# EAGLE design SolarPanel (EAGLE 9.5.1)
DESIGNER: Hendrik Melse; PART_NUMBER: 68-0001; PROJECT: CougSat-1: Solar; REV: 2.1.0
Assembly variants: PV0 (+Z), PV1 (-Y), PV2 (-X), PV3 (+Y)

## Sheet 1 of 5
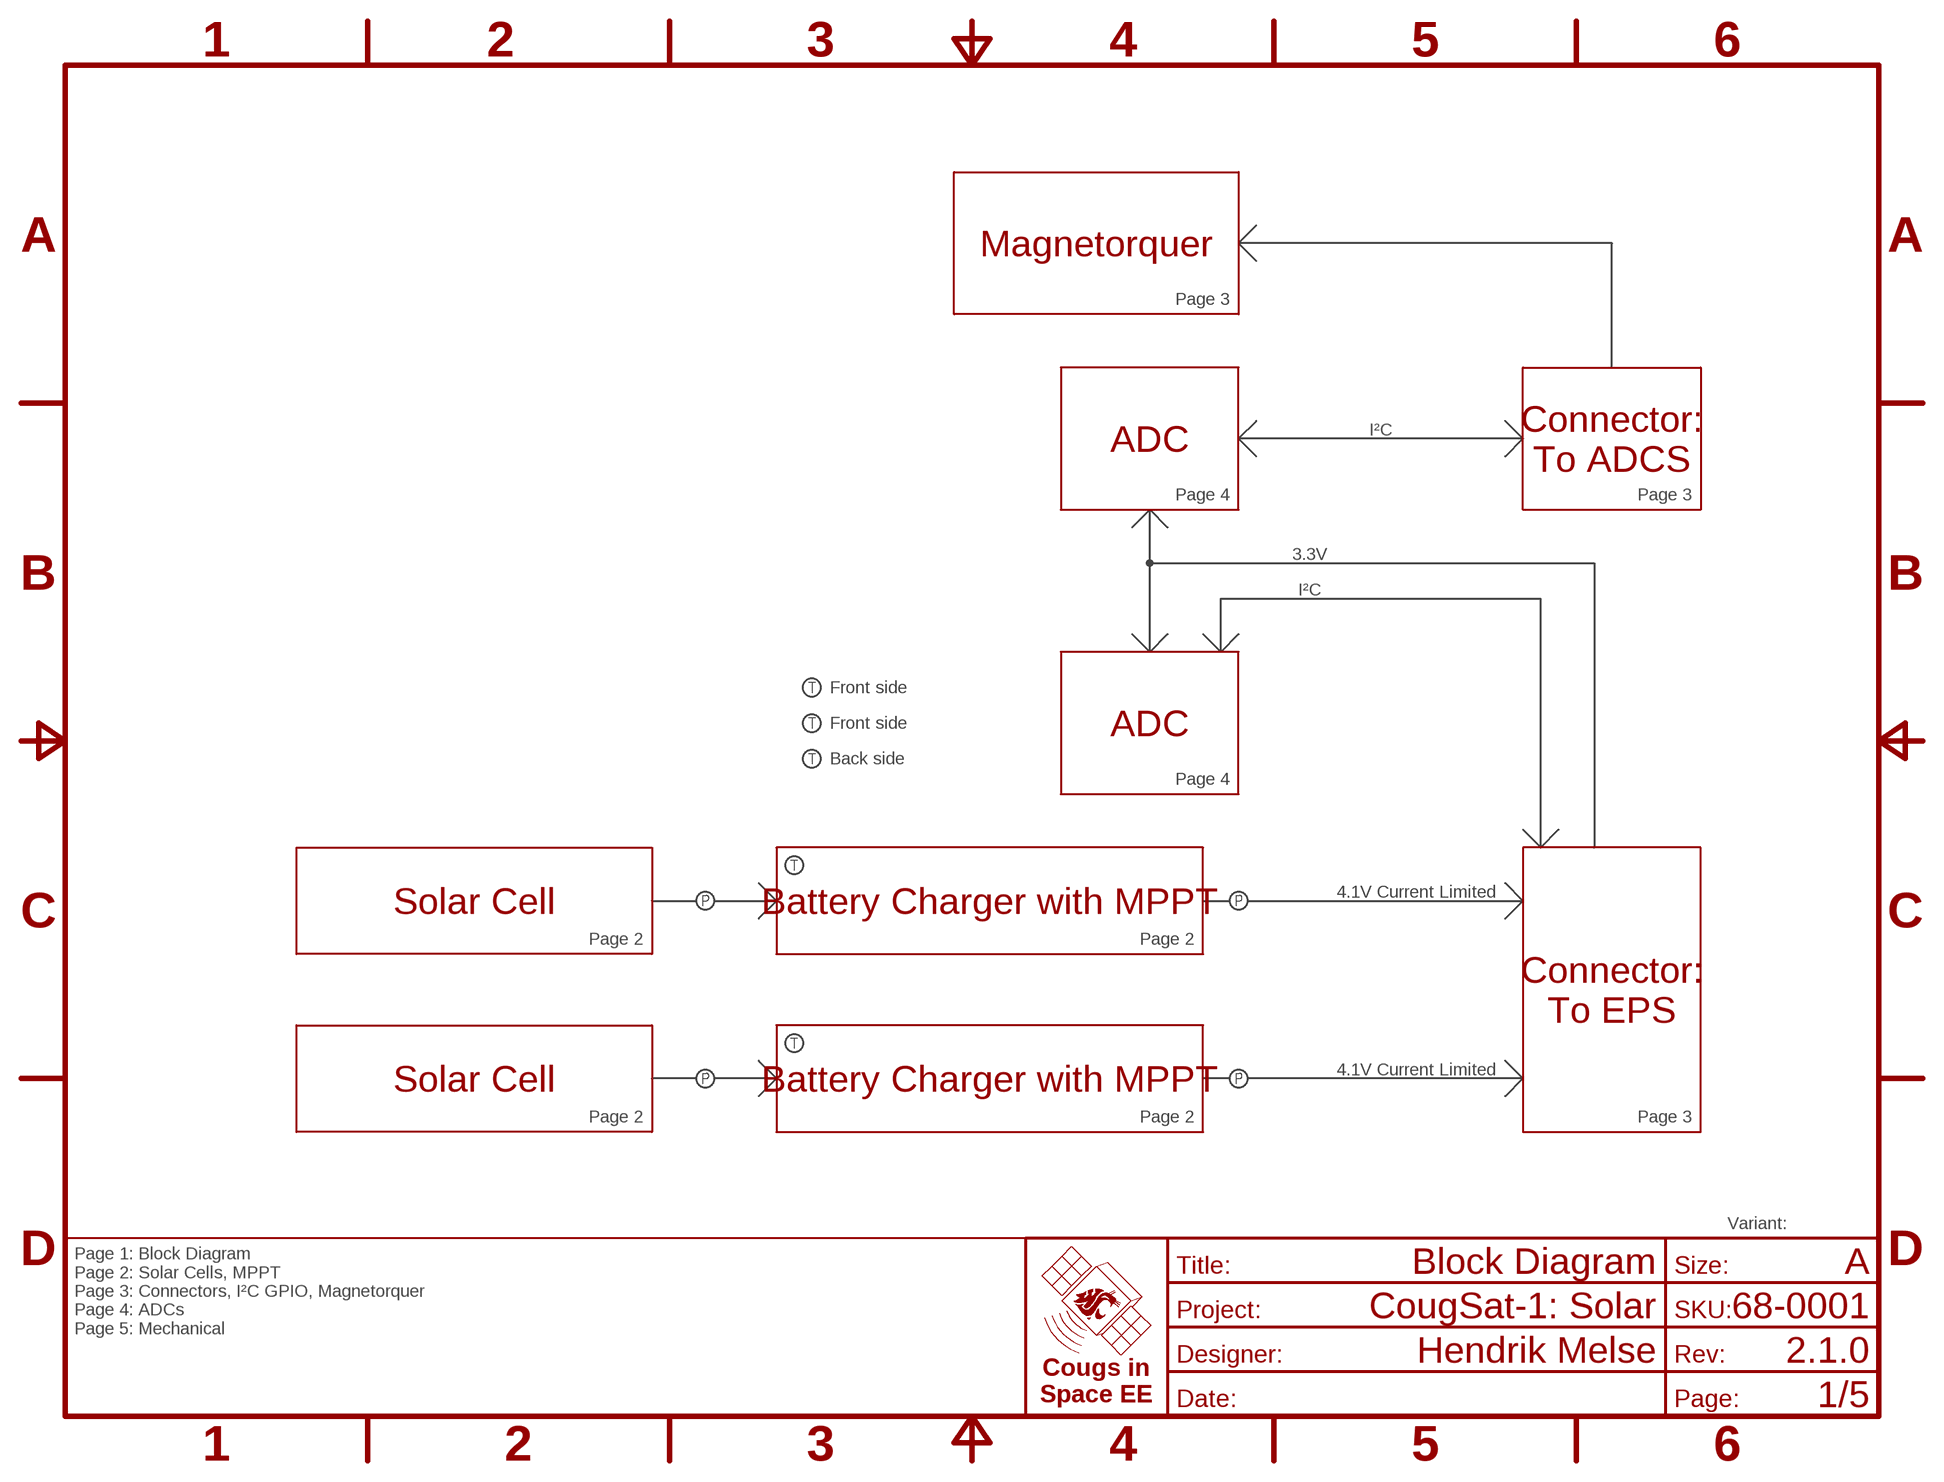
[diagram p0: schematic, sheet 1]
FRAME1 (FRAME-A): TITLE: Block Diagram

### Notes on the sheet
- Magnetorquer
- Page 3
- I²C
- ADC
- Connector:
  To ADCS
- Page 4 | Page 3
- 3.3V
- I²C
- Front side
- Front side | ADC
- Back side
- Page 4
- 4.1V Current Limited
- Solar Cell | Battery Charger with MPPT
- Page 2 | Page 2
- Connector:
  To EPS
- 4.1V Current Limited
- Solar Cell | Battery Charger with MPPT
- Page 2 | Page 2 | Page 3
- Variant:
- Page 1: Block Diagram
  Page 2: Solar Cells, MPPT
  Page 3: Connectors, I²C GPIO, Magnetorquer
  Page 4: ADCs
  Page 5: Mechanical

## Sheet 2 of 5
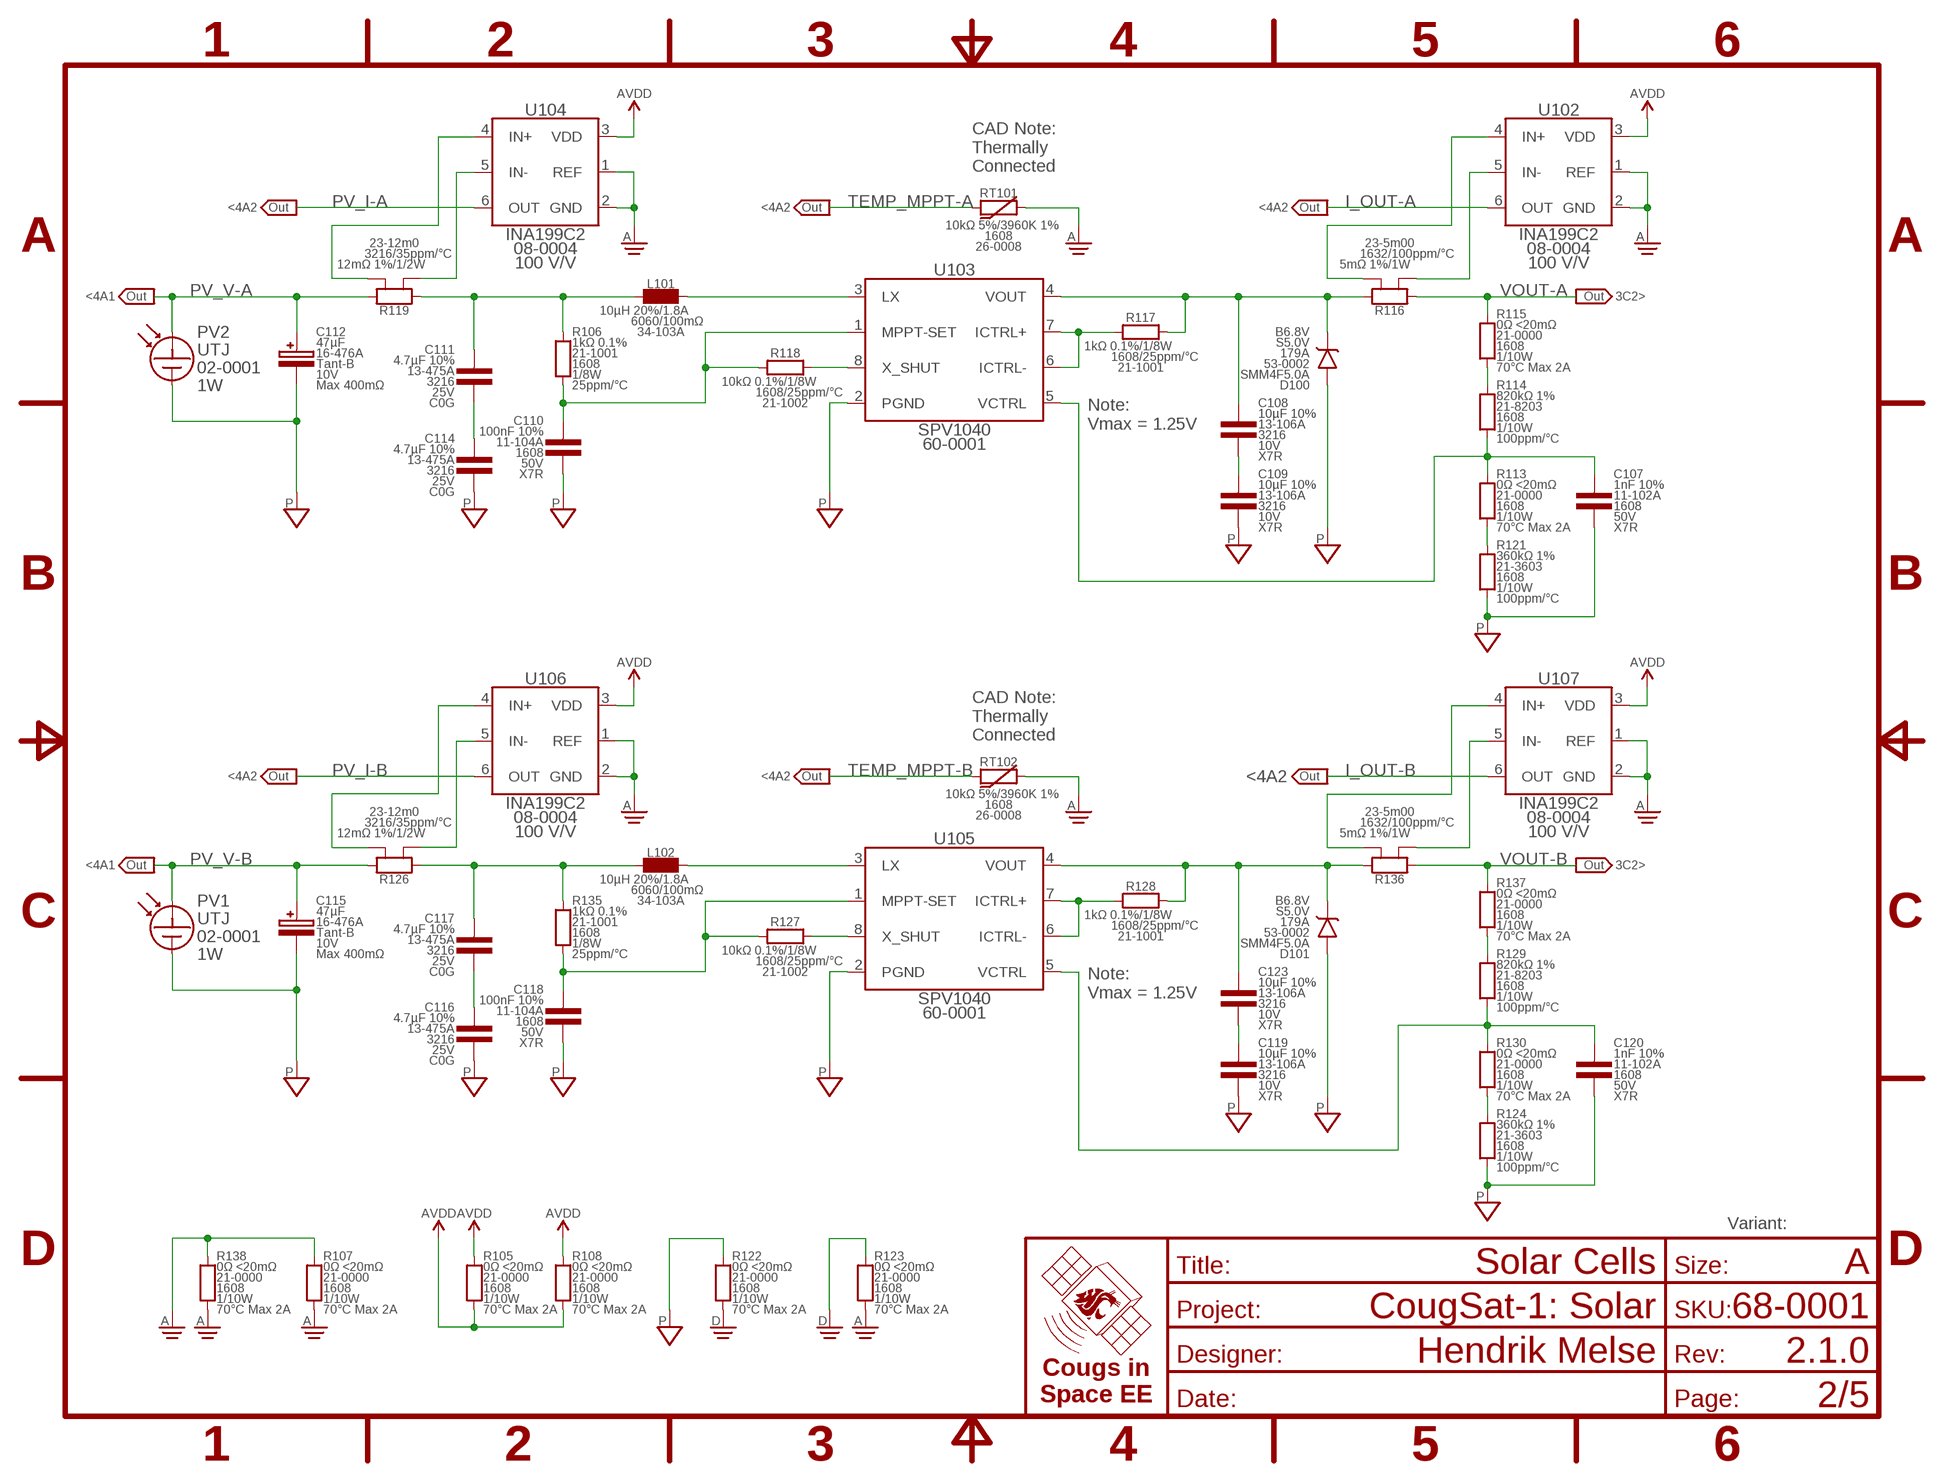
[diagram p1: schematic, sheet 2]
FRAME2 (FRAME-A): TITLE: Solar Cells

### Parts
C107  1nF 10%  CAP-V-1NF-1608  [1608]
C108  10µF 10%  CAP-V-10UF-3216  [3216]
C109  10µF 10%  CAP-V-10UF-3216  [3216]
C110  100nF 10%  CAP-V-100NF-1608  [1608]
C111  4.7µF 10%  CAP-V-4.7UF-3216  [3216]
C112  47µF  CAP-POL-V-47UF-4028  [4028-POL]
C114  4.7µF 10%  CAP-V-4.7UF-3216  [3216]
C115  47µF  CAP-POL-V-47UF-4028  [4028-POL]
C116  4.7µF 10%  CAP-V-4.7UF-3216  [3216]
C117  4.7µF 10%  CAP-V-4.7UF-3216  [3216]
C118  100nF 10%  CAP-V-100NF-1608  [1608]
C119  10µF 10%  CAP-V-10UF-3216  [3216]
C120  1nF 10%  CAP-V-1NF-1608  [1608]
C123  10µF 10%  CAP-V-10UF-3216  [3216]
D100  SMM4F5.0A  DIODE-TVS-V-5.0-STMITE  [STMITE]
D101  SMM4F5.0A  DIODE-TVS-V-5.0-STMITE  [STMITE]
L101  10µH 20%  INDUCTOR-H-10UH-6060  [6060]
L102  10µH 20%  INDUCTOR-H-10UH-6060  [6060]
PV1  UTJ  SOLAR_CELL-UTJ  [SPECTROLABS-UTJ]
PV2  UTJ  SOLAR_CELL-UTJ  [SPECTROLABS-UTJ]
R105  0Ω <20mΩ  RES-V-0-1608  [1608]
R106  1kΩ 0.1%  RES-V-1K-1608  [1608]
R107  0Ω <20mΩ  RES-V-0-1608  [1608]
R108  0Ω <20mΩ  RES-V-0-1608  [1608]
R113  0Ω <20mΩ  RES-V-0-1608  [1608]
R114  820kΩ 1%  RES-V-820K-1608  [1608]
R115  0Ω <20mΩ  RES-V-0-1608  [1608]
R116  5mΩ 1%  RES-H-KELVIN-0.005R-1632  [1632-KELVIN]
R117  1kΩ 0.1%  RES-H-1K-1608  [1608]
R118  10kΩ 0.1%  RES-H-10K-1608  [1608]
R119  12mΩ 1%  RES-H-KELVIN-0.012R-3216  [3216-KELVIN]
R121  360kΩ 1%  RES-V-360K-1608  [1608]
R122  0Ω <20mΩ  RES-V-0-1608  [1608]
R123  0Ω <20mΩ  RES-V-0-1608  [1608]
R124  360kΩ 1%  RES-V-360K-1608  [1608]
R126  12mΩ 1%  RES-H-KELVIN-0.012R-3216  [3216-KELVIN]
R127  10kΩ 0.1%  RES-H-10K-1608  [1608]
R128  1kΩ 0.1%  RES-H-1K-1608  [1608]
R129  820kΩ 1%  RES-V-820K-1608  [1608]
R130  0Ω <20mΩ  RES-V-0-1608  [1608]
R135  1kΩ 0.1%  RES-V-1K-1608  [1608]
R136  5mΩ 1%  RES-H-KELVIN-0.005R-1632  [1632-KELVIN]
R137  0Ω <20mΩ  RES-V-0-1608  [1608]
R138  0Ω <20mΩ  RES-V-0-1608  [1608]
RT101  10kΩ 5%  THERMISTOR-H-10K-1608  [1608]
RT102  10kΩ 5%  THERMISTOR-H-10K-1608  [1608]
U102  INA199C2  [SOT363]
U103  SPV1040  [TSSOP8]
U104  INA199C2  [SOT363]
U105  SPV1040  [TSSOP8]
U106  INA199C2  [SOT363]
U107  INA199C2  [SOT363]

### Nets
AGND: R107.1 R107.2 R123.1 R138.1 R138.2 RT101.2 RT102.2 U102.1(REF) U102.2(GND) U104.1(REF) U104.2(GND) U106.1(REF) U106.2(GND) U107.1(REF) U107.2(GND) ; also sheet 3,4
AVDD: R105.1 R105.2 R108.1 R108.2 U102.3(VDD) U104.3(VDD) U106.3(VDD) U107.3(VDD) ; also sheet 3,4
DGND: R122.1 R123.2 ; also sheet 4
I_OUT-A: U102.6(OUT) ; also sheet 4
I_OUT-B: U107.6(OUT) ; also sheet 4
MPPT_FBRES_HIGH-A: R114.2 R115.1
MPPT_FBRES_HIGH-B: R129.2 R137.1
MPPT_FBRES_LOW-A: R113.1 R121.2
MPPT_FBRES_LOW-B: R124.2 R130.1
MPPT_ICTRL-A: R117.1 U103.6(ICTRL-) U103.7(ICTRL+)
MPPT_ICTRL-B: R128.1 U105.6(ICTRL-) U105.7(ICTRL+)
MPPT_LX-A: L101.2 U103.3(LX)
MPPT_LX-B: L102.2 U105.3(LX)
MPPT_OUTCAP-A: C108.2 C109.1
MPPT_OUTCAP-B: C119.1 C123.2
MPPT_SET-A: C110.1 R106.1 R118.1 U103.1(MPPT-SET)
MPPT_SET-B: C118.1 R127.1 R135.1 U105.1(MPPT-SET)
MPPT_VCTRL-A: C107.1 R113.2 R114.1 U103.5(VCTRL)
MPPT_VCTRL-B: C120.1 R129.1 R130.2 U105.5(VCTRL)
MPPT_VOUT-A: C108.1 D100.C R116.1 R117.2 U103.4(VOUT)
MPPT_VOUT-B: C123.1 D101.C R128.2 R136.1 U105.4(VOUT)
OUTPUT_CAP-A: C111.2 C114.1
OUTPUT_CAP-B: C116.1 C117.2
PGND: C107.2 C109.2 C110.2 C112.C C114.2 C115.C C116.2 C118.2 C119.2 C120.2 D100.A D101.A PV1.VSS@1(A) PV1.VSS@2(A) PV1.VSS@3(A) PV2.VSS@1(A) PV2.VSS@2(A) PV2.VSS@3(A) R121.1 R122.2 R124.1 U103.2(PGND) U105.2(PGND) ; also sheet 3,5
PV_I-A: U104.6(OUT) ; also sheet 4
PV_I-B: U106.6(OUT) ; also sheet 4
PV_I_N-A: R119.2-KELVIN U104.5(IN-)
PV_I_N-B: R126.2-KELVIN U106.5(IN-)
PV_I_P-A: R119.1-KELVIN U104.4(IN+)
PV_I_P-B: R126.1-KELVIN U106.4(IN+)
PV_IIN_N-A: C111.1 L101.1 R106.2 R119.2
PV_IIN_N-B: C117.1 L102.1 R126.2 R135.2
PV_V-A: C112.A PV2.VCC@1(C) PV2.VCC@2(C) PV2.VCC@3(C) PV2.VCC@4(C) R119.1 ; also sheet 4
PV_V-B: C115.A PV1.VCC@1(C) PV1.VCC@2(C) PV1.VCC@3(C) PV1.VCC@4(C) R126.1 ; also sheet 4
TEMP_MPPT-A: RT101.1 ; also sheet 4
TEMP_MPPT-B: RT102.1 ; also sheet 4
VOUT-A: R115.2 R116.2 ; also sheet 3
VOUT-B: R136.2 R137.2 ; also sheet 3
VOUT_N-A: R116.2-KELVIN U102.5(IN-)
VOUT_N-B: R136.2-KELVIN U107.5(IN-)
VOUT_P-A: R116.1-KELVIN U102.4(IN+)
VOUT_P-B: R136.1-KELVIN U107.4(IN+)
X_SHUT-A: R118.2 U103.8(X_SHUT)
X_SHUT-B: R127.2 U105.8(X_SHUT)

### Notes on the sheet
- CAD Note:
  Thermally
  Connected
- <4A2 | <4A2 | <4A2
- <4A1 | 3C2>
- Note:
  Vmax = 1.25V
- CAD Note:
  Thermally
  Connected
- <4A2 | <4A2 | <4A2
- <4A1 | 3C2>
- Note:
  Vmax = 1.25V
- Variant:

## Sheet 3 of 5
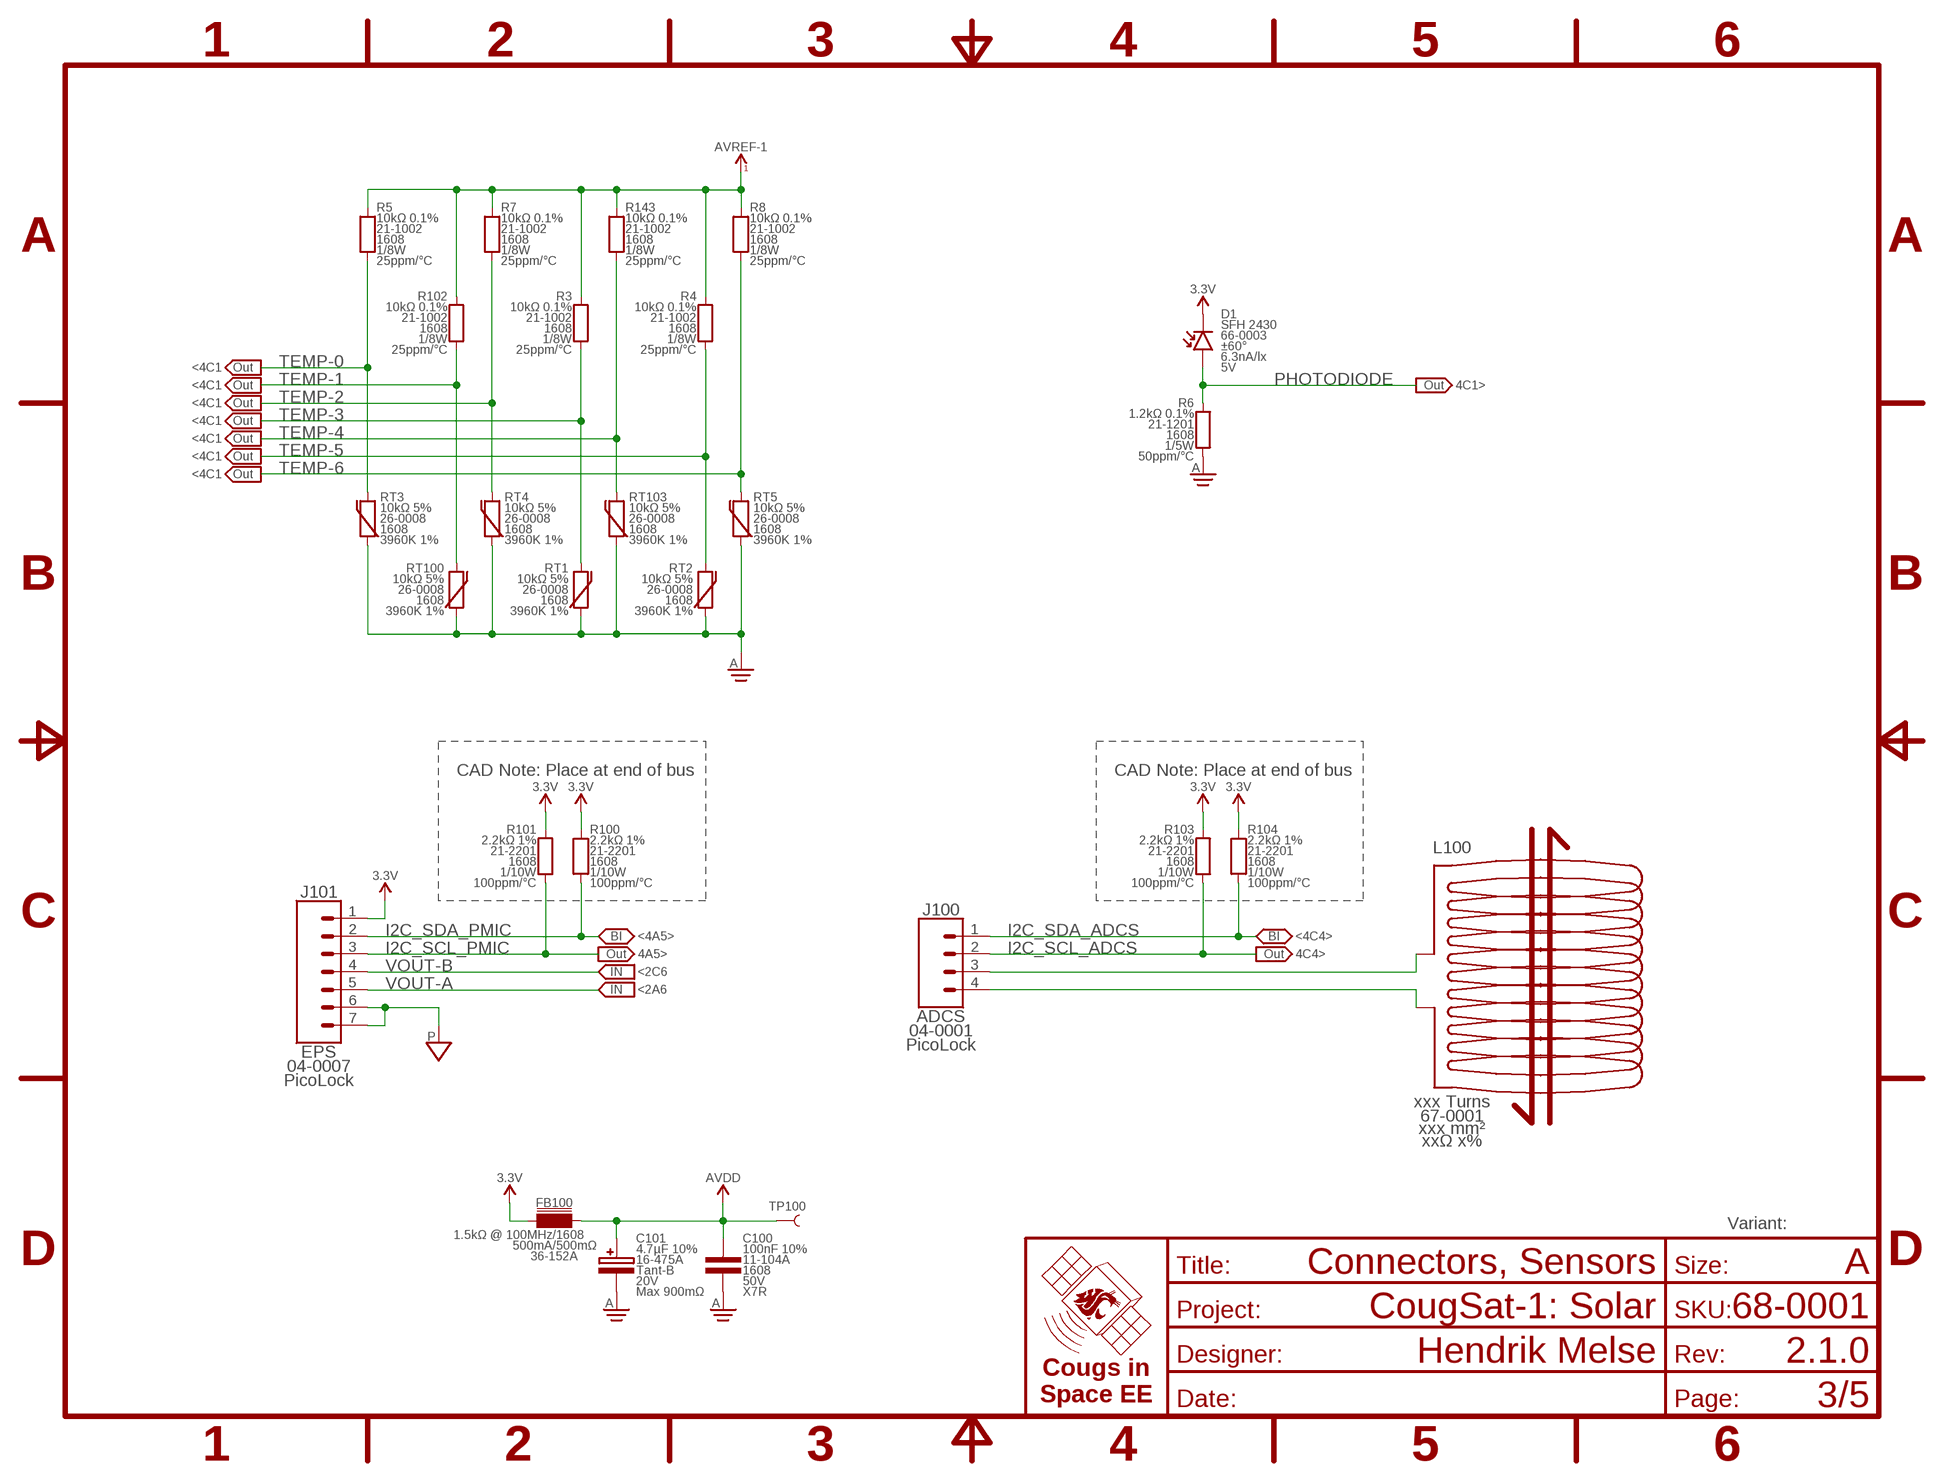
[diagram p2: schematic, sheet 3]
FRAME3 (FRAME-A): TITLE: Connectors, Sensors

### Parts
C100  100nF 10%  CAP-V-100NF-1608  [1608]
C101  4.7µF 10%  CAP-POL-V-4.7UF-4028  [4028-POL]
D1  SFH 2430  PHOTODIODE-SFH2430  [SFH2430]
FB100  1.5kΩ @ 100MHz  CHOKE-H-1.5K-1608  [1608]
J100  ADCS  1X04-PICOLOCK  [PICOLOCK1.5-04]
J101  EPS  1X07-PICOLOCK  [PICOLOCK1.5-07]
L100  xxx Turns  MAGNETORQUER-1UPV-SMD-3030  [SMD-3030-2]  (not fitted in variant PV3 (+Y))
R3  10kΩ 0.1%  RES-V-10K-1608  [1608]
R4  10kΩ 0.1%  RES-V-10K-1608  [1608]
R5  10kΩ 0.1%  RES-V-10K-1608  [1608]
R6  1.2kΩ 0.1%  RES-V-1.2K-1608  [1608]
R7  10kΩ 0.1%  RES-V-10K-1608  [1608]
R8  10kΩ 0.1%  RES-V-10K-1608  [1608]
R100  2.2kΩ 1%  RES-V-2.2K-1608  [1608]  (not fitted in variant PV0 (+Z))  (not fitted in variant PV1 (-Y))  (not fitted in variant PV2 (-X))  (not fitted in variant PV3 (+Y))
R101  2.2kΩ 1%  RES-V-2.2K-1608  [1608]  (not fitted in variant PV0 (+Z))  (not fitted in variant PV1 (-Y))  (not fitted in variant PV2 (-X))  (not fitted in variant PV3 (+Y))
R102  10kΩ 0.1%  RES-V-10K-1608  [1608]
R103  2.2kΩ 1%  RES-V-2.2K-1608  [1608]  (not fitted in variant PV0 (+Z))  (not fitted in variant PV1 (-Y))  (not fitted in variant PV2 (-X))  (not fitted in variant PV3 (+Y))
R104  2.2kΩ 1%  RES-V-2.2K-1608  [1608]  (not fitted in variant PV0 (+Z))  (not fitted in variant PV1 (-Y))  (not fitted in variant PV2 (-X))  (not fitted in variant PV3 (+Y))
R143  10kΩ 0.1%  RES-V-10K-1608  [1608]
RT1  10kΩ 5%  THERMISTOR-V-10K-1608  [1608]
RT2  10kΩ 5%  THERMISTOR-V-10K-1608  [1608]
RT3  10kΩ 5%  THERMISTOR-V-10K-1608  [1608]
RT4  10kΩ 5%  THERMISTOR-V-10K-1608  [1608]
RT5  10kΩ 5%  THERMISTOR-V-10K-1608  [1608]
RT100  10kΩ 5%  THERMISTOR-V-10K-1608  [1608]
RT103  10kΩ 5%  THERMISTOR-V-10K-1608  [1608]
TP100  TEST_POINT-SMD-C-1.25  [SMD-C-1.25]

### Nets
3.3V: D1.C FB100.1 J101.1 R100.2 R101.2 R103.2 R104.2 ; also sheet 4
AGND: C100.2 C101.C R6.1 RT1.1 RT2.1 RT3.1 RT4.1 RT5.1 RT100.1 RT103.1 ; also sheet 2,4
AVDD: C100.1 C101.A FB100.2 TP100.1 ; also sheet 2,4
AVREF-1: R3.2 R4.2 R5.2 R7.2 R8.2 R102.2 R143.2 ; also sheet 4
I2C_SCL_ADCS: J100.2 R103.1 ; also sheet 4
I2C_SCL_PMIC: J101.3 R101.1 ; also sheet 4
I2C_SDA_ADCS: J100.1 R104.1 ; also sheet 4
I2C_SDA_PMIC: J101.2 R100.1 ; also sheet 4
MAGNETORQUER-IN: J100.3 L100.1
MAGNETORQUER_OUT: J100.4 L100.2
PGND: J101.6 J101.7 ; also sheet 2,5
PHOTODIODE: D1.A R6.2 ; also sheet 4
TEMP-0: R5.1 RT3.2 ; also sheet 4
TEMP-1: R102.1 RT100.2 ; also sheet 4
TEMP-2: R7.1 RT4.2 ; also sheet 4
TEMP-3: R3.1 RT1.2 ; also sheet 4
TEMP-4: R143.1 RT103.2 ; also sheet 4
TEMP-5: R4.1 RT2.2 ; also sheet 4
TEMP-6: R8.1 RT5.2 ; also sheet 4
VOUT-A: J101.5 ; also sheet 2
VOUT-B: J101.4 ; also sheet 2

### Notes on the sheet
- <4C1
- <4C1 | 4C1>
- <4C1
- <4C1
- <4C1
- <4C1
- <4C1
- CAD Note: Place at end of bus | CAD Note: Place at end of bus
- <4A5> | <4C4>
- 4A5> | 4C4>
- <2C6
- <2A6
- Variant:

## Sheet 4 of 5
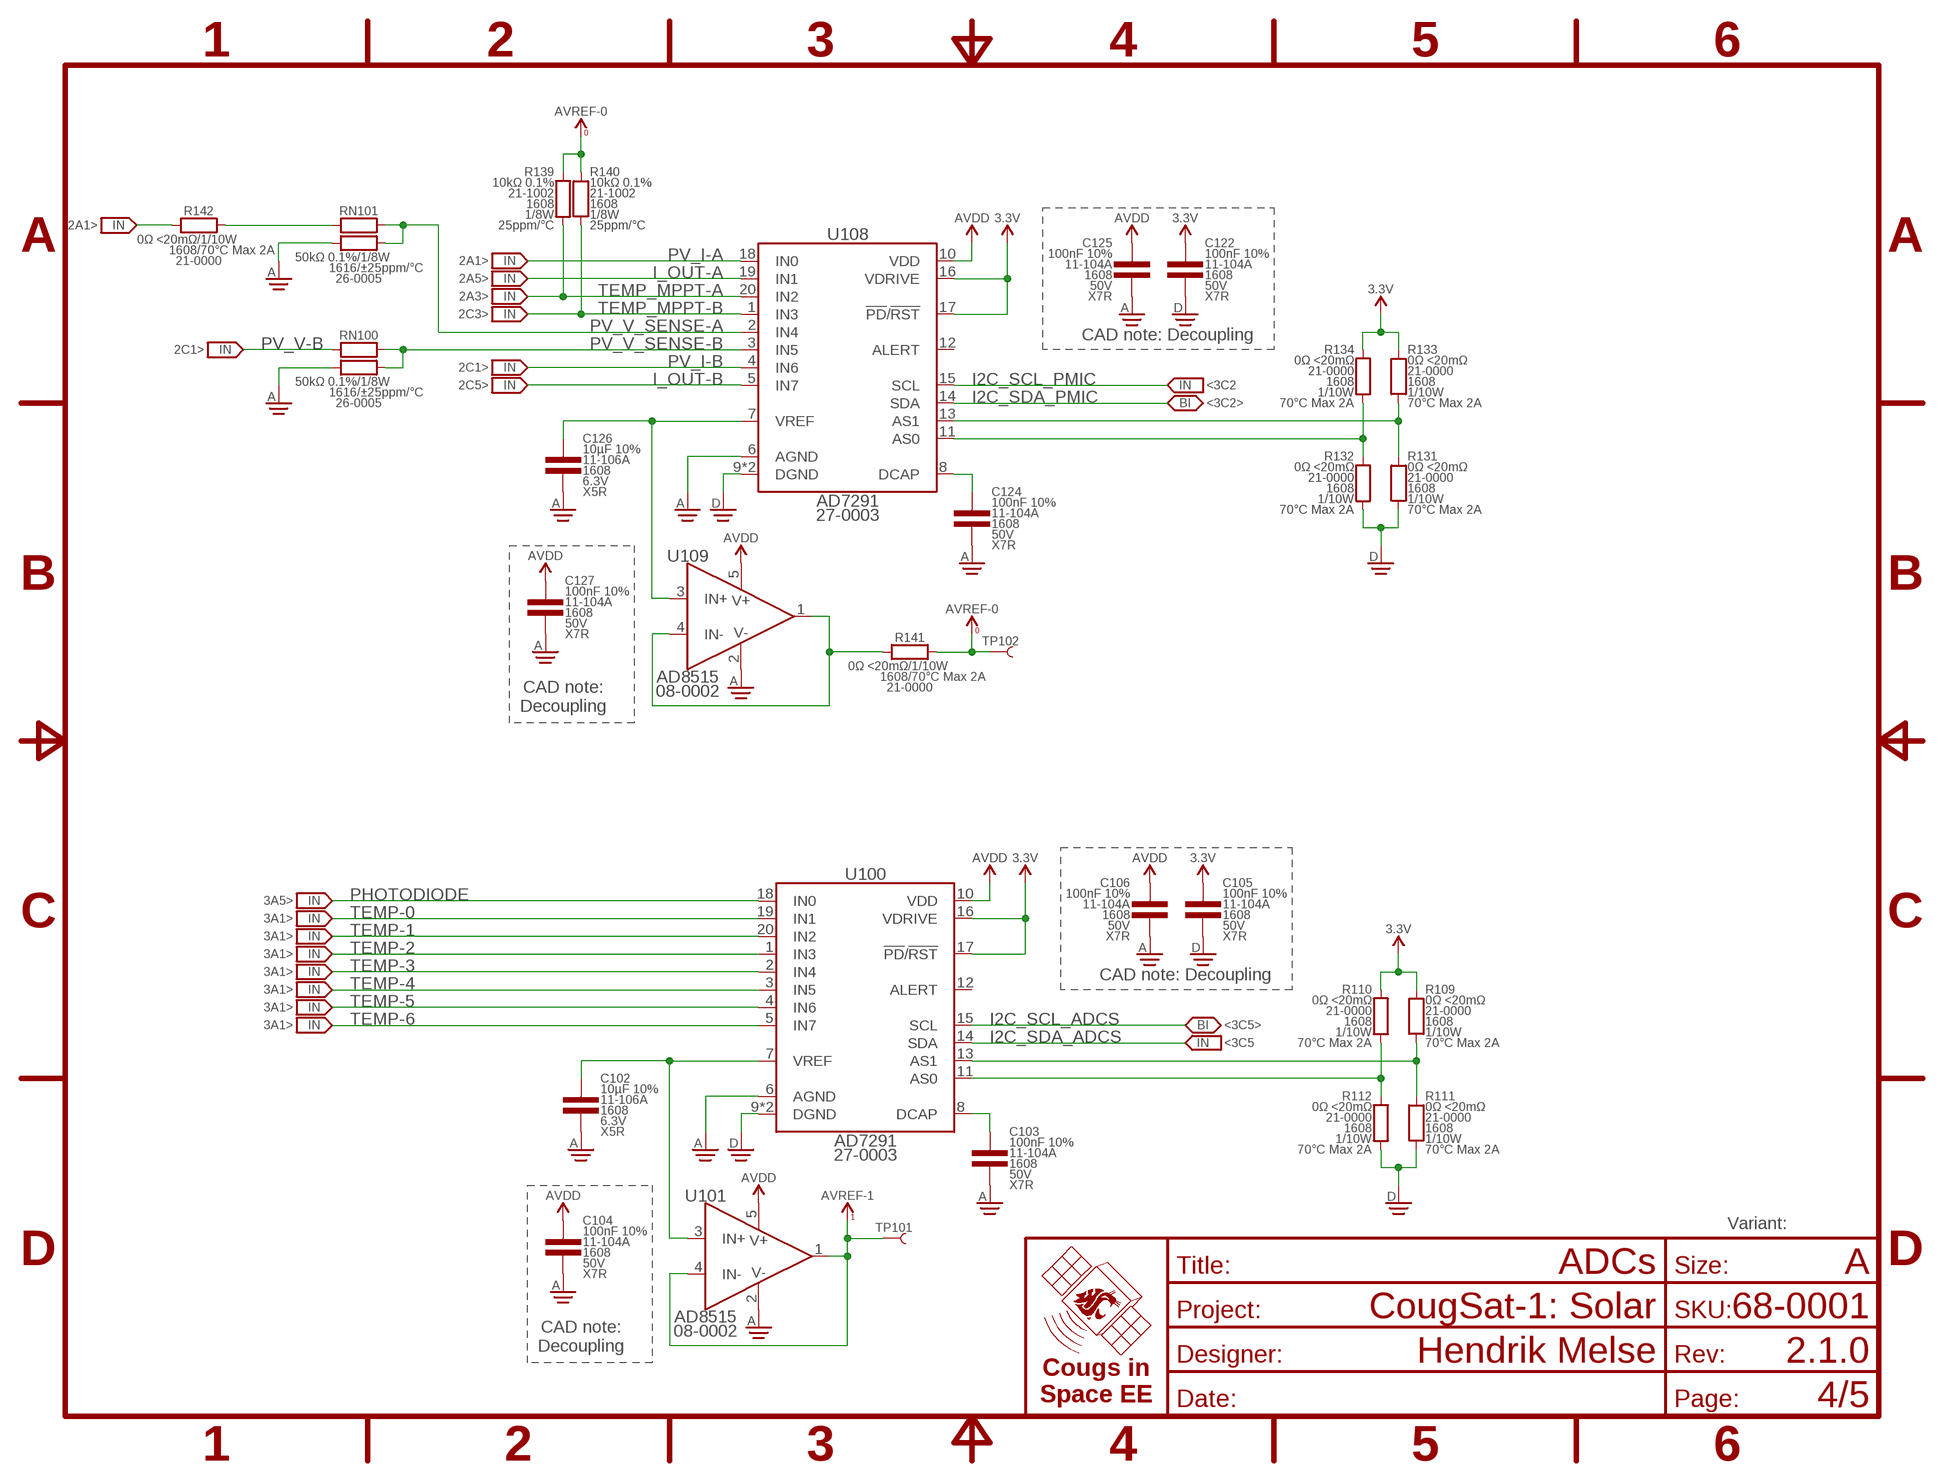
[diagram p3: schematic, sheet 4]
FRAME4 (FRAME-A): TITLE: ADCs

### Parts
C102  10µF 10%  CAP-V-10UF-1608  [1608]
C103  100nF 10%  CAP-V-100NF-1608  [1608]
C104  100nF 10%  CAP-V-100NF-1608  [1608]
C105  100nF 10%  CAP-V-100NF-1608  [1608]
C106  100nF 10%  CAP-V-100NF-1608  [1608]
C122  100nF 10%  CAP-V-100NF-1608  [1608]
C124  100nF 10%  CAP-V-100NF-1608  [1608]
C125  100nF 10%  CAP-V-100NF-1608  [1608]
C126  10µF 10%  CAP-V-10UF-1608  [1608]
C127  100nF 10%  CAP-V-100NF-1608  [1608]
R109  0Ω <20mΩ  RES-V-0-1608  [1608]  (not fitted in variant PV0 (+Z))  (not fitted in variant PV1 (-Y))
R110  0Ω <20mΩ  RES-V-0-1608  [1608]  (not fitted in variant PV0 (+Z))  (not fitted in variant PV2 (-X))  (not fitted in variant PV3 (+Y))
R111  0Ω <20mΩ  RES-V-0-1608  [1608]  (not fitted in variant PV0 (+Z))  (not fitted in variant PV1 (-Y))  (not fitted in variant PV2 (-X))  (not fitted in variant PV3 (+Y))
R112  0Ω <20mΩ  RES-V-0-1608  [1608]  (not fitted in variant PV1 (-Y))  (not fitted in variant PV2 (-X))  (not fitted in variant PV0 (+Z))
R131  0Ω <20mΩ  RES-V-0-1608  [1608]  (not fitted in variant PV0 (+Z))  (not fitted in variant PV1 (-Y))  (not fitted in variant PV2 (-X))  (not fitted in variant PV3 (+Y))
R132  0Ω <20mΩ  RES-V-0-1608  [1608]  (not fitted in variant PV0 (+Z))  (not fitted in variant PV1 (-Y))  (not fitted in variant PV2 (-X))
R133  0Ω <20mΩ  RES-V-0-1608  [1608]  (not fitted in variant PV0 (+Z))  (not fitted in variant PV1 (-Y))
R134  0Ω <20mΩ  RES-V-0-1608  [1608]  (not fitted in variant PV0 (+Z))  (not fitted in variant PV2 (-X))  (not fitted in variant PV3 (+Y))
R139  10kΩ 0.1%  RES-V-10K-1608  [1608]
R140  10kΩ 0.1%  RES-V-10K-1608  [1608]
R141  0Ω <20mΩ  RES-H-0-1608  [1608]
R142  0Ω <20mΩ  RES-H-0-1608  [1608]
RN100  50kΩ 0.1%  RES-H-PAIRED-50K-1616  [1616]
RN101  50kΩ 0.1%  RES-H-PAIRED-50K-1616  [1616]
TP101  TEST_POINT-SMD-C-1.25  [SMD-C-1.25]
TP102  TEST_POINT-SMD-C-1.25  [SMD-C-1.25]
U100  AD7291  [QFN-20-4040]
U101  AD8515  OPAMP-1-AD8515  [SOT23-5]
U108  AD7291  [QFN-20-4040]
U109  AD8515  OPAMP-1-AD8515  [SOT23-5]

### Nets
3.3V: C105.1 C122.1 R109.2 R110.2 R133.2 R134.2 U100.16(VDRIVE) U100.17(!PD!/!RST) U108.16(VDRIVE) U108.17(!PD!/!RST) ; also sheet 3
ADC_AS0-ADCS: R110.1 R112.2 U100.11(AS0)
ADC_AS0-EPS: R132.2 R134.1 U108.11(AS0)
ADC_AS1-ADCS: R109.1 R111.2 U100.13(AS1)
ADC_AS1-EPS: R131.2 R133.1 U108.13(AS1)
ADC_DCAP-ADCS: C103.1 U100.8(DCAP)
ADC_DCAP-EPS: C124.1 U108.8(DCAP)
ADC_VREF-ADCS: C102.1 U100.7(VREF) U101.3(IN+)
ADC_VREF-EPS: C126.1 U108.7(VREF) U109.3(IN+)
AGND: C102.2 C103.2 C104.2 C106.2 C124.2 C125.2 C126.2 C127.2 RN100.1(A1) RN101.1(A1) U100.6(AGND) U101.2(V-) U108.6(AGND) U109.2(V-) ; also sheet 2,3
AVDD: C104.1 C106.1 C125.1 C127.1 U100.10(VDD) U101.5(V+) U108.10(VDD) U109.5(V+) ; also sheet 2,3
AVREF-0: R139.2 R140.2 R141.2 TP102.1
AVREF-1: TP101.1 U101.1(OUT) U101.4(IN-) ; also sheet 3
AVREF-BUFF: R141.1 U109.1(OUT) U109.4(IN-)
DGND: C105.2 C122.2 R111.1 R112.1 R131.1 R132.1 U100.9(DGND) U100.PAD(DGND) U108.9(DGND) U108.PAD(DGND) ; also sheet 2
I2C_SCL_ADCS: U100.15(SCL) ; also sheet 3
I2C_SCL_PMIC: U108.15(SCL) ; also sheet 3
I2C_SDA_ADCS: U100.14(SDA) ; also sheet 3
I2C_SDA_PMIC: U108.14(SDA) ; also sheet 3
I_OUT-A: U108.19(IN1) ; also sheet 2
I_OUT-B: U108.5(IN7) ; also sheet 2
PHOTODIODE: U100.18(IN0) ; also sheet 3
PV_I-A: U108.18(IN0) ; also sheet 2
PV_I-B: U108.4(IN6) ; also sheet 2
PV_V-A: R142.1 ; also sheet 2
PV_V-A_JUMP: R142.2 RN101.2(B1)
PV_V-B: RN100.2(B1) ; also sheet 2
PV_V_SENSE-A: RN101.3(B2) RN101.4(A2) U108.2(IN4)
PV_V_SENSE-B: RN100.3(B2) RN100.4(A2) U108.3(IN5)
TEMP-0: U100.19(IN1) ; also sheet 3
TEMP-1: U100.20(IN2) ; also sheet 3
TEMP-2: U100.1(IN3) ; also sheet 3
TEMP-3: U100.2(IN4) ; also sheet 3
TEMP-4: U100.3(IN5) ; also sheet 3
TEMP-5: U100.4(IN6) ; also sheet 3
TEMP-6: U100.5(IN7) ; also sheet 3
TEMP_MPPT-A: R139.1 U108.20(IN2) ; also sheet 2
TEMP_MPPT-B: R140.1 U108.1(IN3) ; also sheet 2
Unconnected: U100.12(ALERT) U108.12(ALERT)

### Notes on the sheet
- 2A1>
- 2A1>
- 2A5>
- 2A3>
- 2C3>
- CAD note: Decoupling
- 2C1>
- 2C1>
- 2C5> | <3C2
- <3C2>
- CAD note:
  Decoupling
- 3A5>
- 3A1>
- 3A1>
- 3A1>
- 3A1>
- CAD note: Decoupling
- 3A1>
- 3A1>
- 3A1> | <3C5>
- <3C5
- Variant:
- CAD note:
  Decoupling

## Sheet 5 of 5
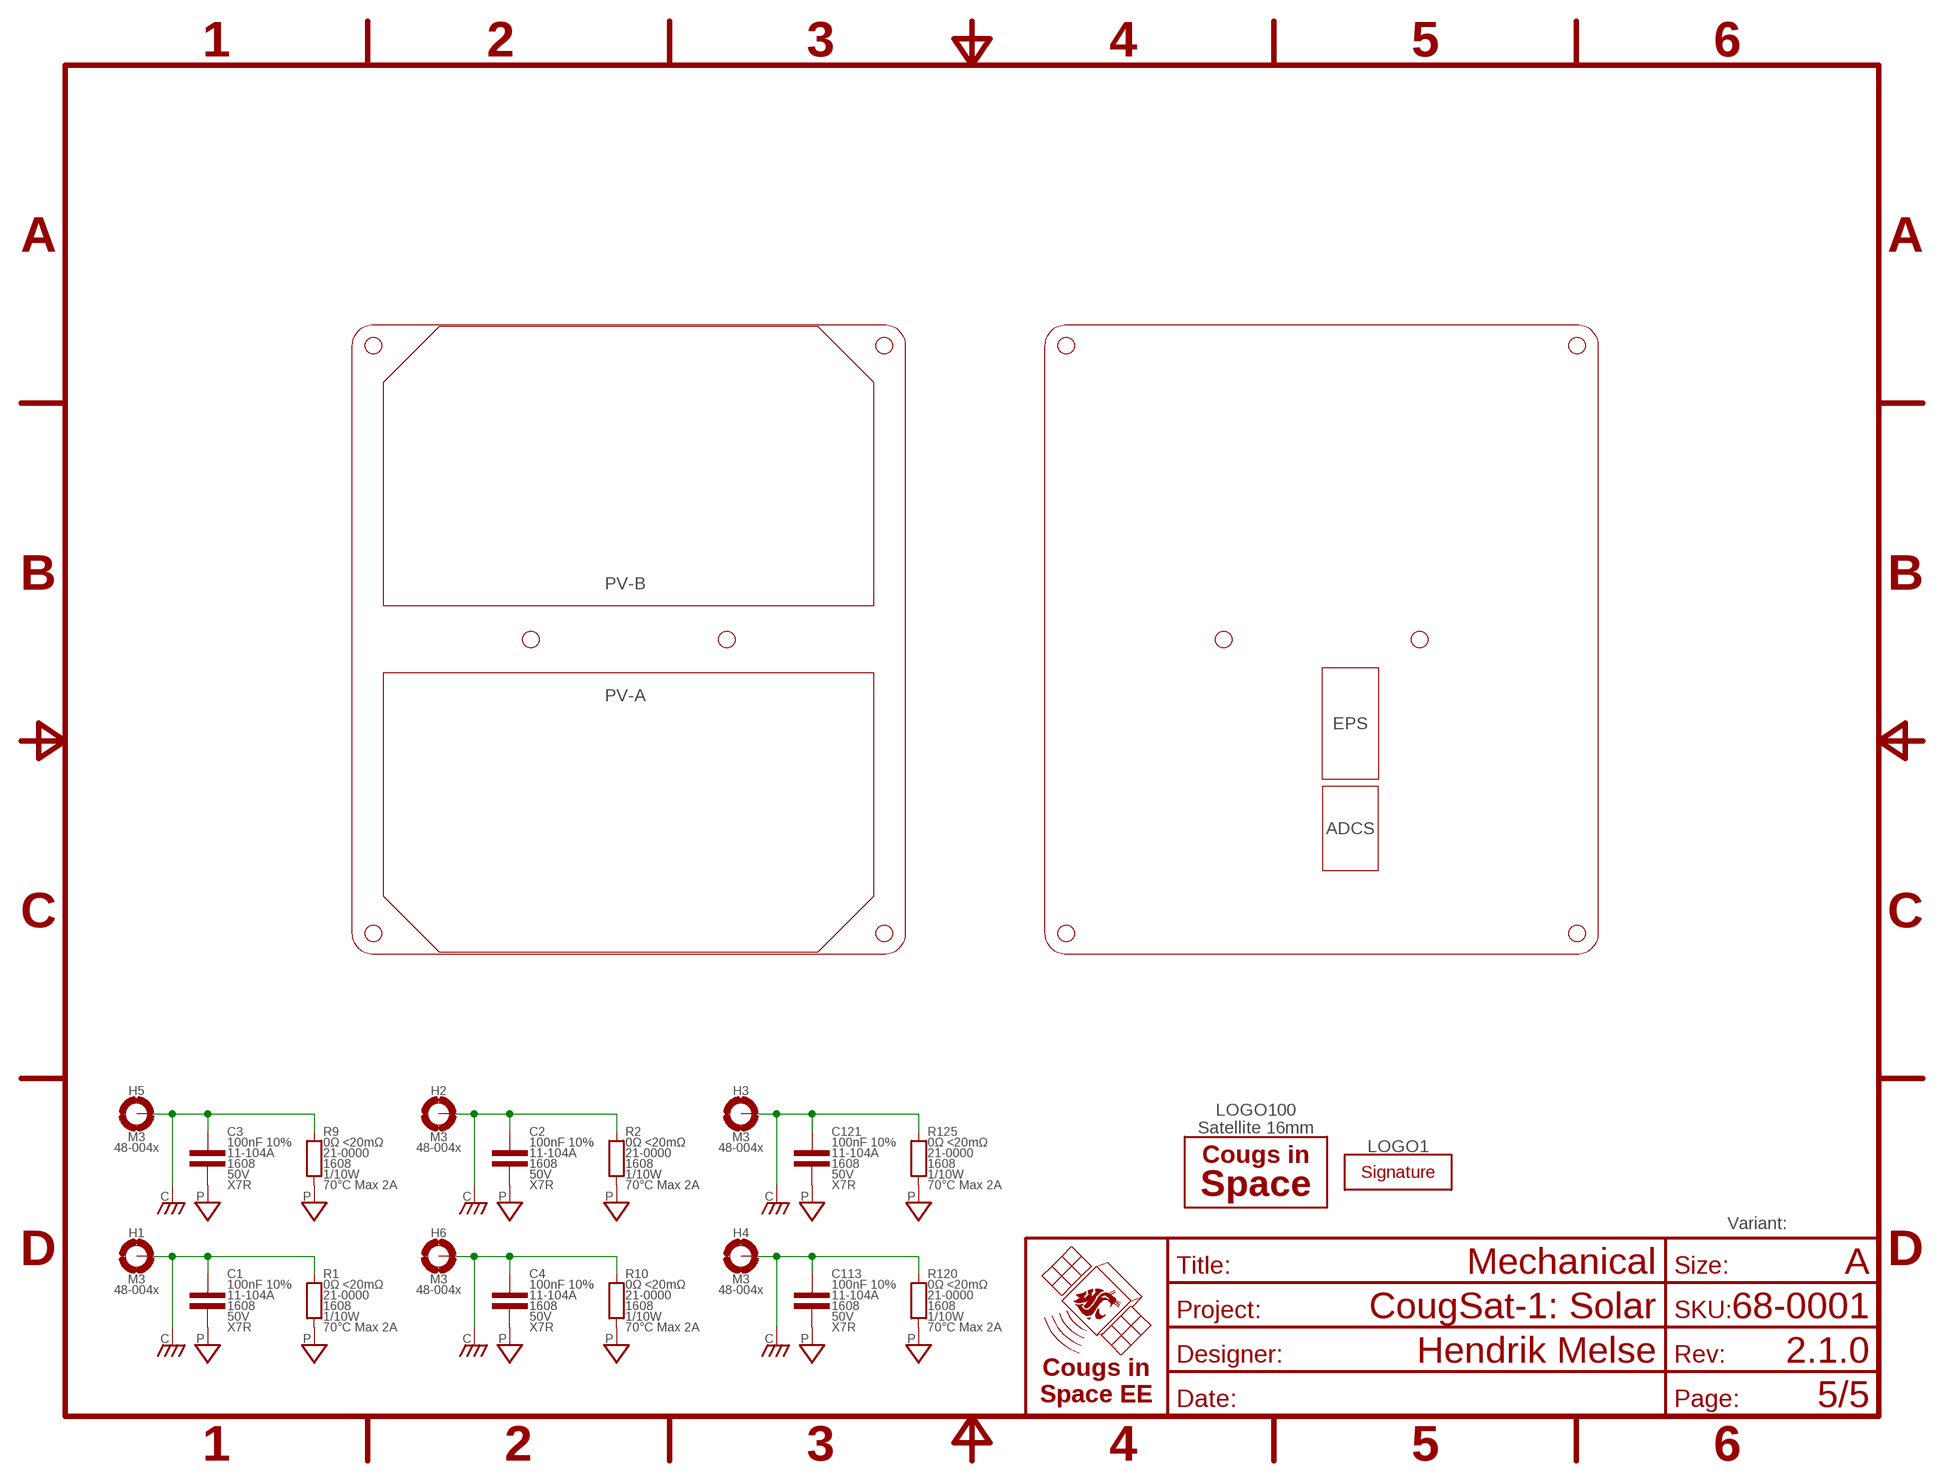
[diagram p4: schematic, sheet 5]
FRAME5 (FRAME-A): TITLE: Mechanical

### Parts
C1  100nF 10%  CAP-V-100NF-1608  [1608]
C2  100nF 10%  CAP-V-100NF-1608  [1608]
C3  100nF 10%  CAP-V-100NF-1608  [1608]
C4  100nF 10%  CAP-V-100NF-1608  [1608]
C113  100nF 10%  CAP-V-100NF-1608  [1608]
C121  100nF 10%  CAP-V-100NF-1608  [1608]
H1  M3  MOUNTING_HOLE-3.3  [MOUNTING_HOLE-3.3]
H2  M3  MOUNTING_HOLE-3.3  [MOUNTING_HOLE-3.3]
H3  M3  MOUNTING_HOLE-3.3  [MOUNTING_HOLE-3.3]
H4  M3  MOUNTING_HOLE-3.3  [MOUNTING_HOLE-3.3]
H5  M3  MOUNTING_HOLE-3.3  [MOUNTING_HOLE-3.3]
H6  M3  MOUNTING_HOLE-3.3  [MOUNTING_HOLE-3.3]
LOGO1  SIGNATUREHENDRIK  [SIGN-HENDRIK]
LOGO100  Satellite 16mm  CIS-LOGO-SATELLITE-16MM  [CIS-SATELLITE-16]
R1  0Ω <20mΩ  RES-V-0-1608  [1608]
R2  0Ω <20mΩ  RES-V-0-1608  [1608]
R9  0Ω <20mΩ  RES-V-0-1608  [1608]
R10  0Ω <20mΩ  RES-V-0-1608  [1608]
R120  0Ω <20mΩ  RES-V-0-1608  [1608]
R125  0Ω <20mΩ  RES-V-0-1608  [1608]

### Nets
CHASSIS: C1.1 C2.1 C3.1 C4.1 C113.1 C121.1 H1.1(MOUNT) H1.V1(MOUNT) H1.V2(MOUNT) H1.V3(MOUNT) H1.V4(MOUNT) H1.V5(MOUNT) H1.V6(MOUNT) H1.V7(MOUNT) H1.V8(MOUNT) H1.V9(MOUNT) H1.V10(MOUNT) H2.1(MOUNT) H2.V1(MOUNT) H2.V2(MOUNT) H2.V3(MOUNT) H2.V4(MOUNT) H2.V5(MOUNT) H2.V6(MOUNT) H2.V7(MOUNT) H2.V8(MOUNT) H2.V9(MOUNT) H2.V10(MOUNT) H3.1(MOUNT) H3.V1(MOUNT) H3.V2(MOUNT) H3.V3(MOUNT) H3.V4(MOUNT) H3.V5(MOUNT) H3.V6(MOUNT) H3.V7(MOUNT) H3.V8(MOUNT) H3.V9(MOUNT) H3.V10(MOUNT) H4.1(MOUNT) H4.V1(MOUNT) H4.V2(MOUNT) H4.V3(MOUNT) H4.V4(MOUNT) H4.V5(MOUNT) H4.V6(MOUNT) H4.V7(MOUNT) H4.V8(MOUNT) H4.V9(MOUNT) H4.V10(MOUNT) H5.1(MOUNT) H5.V1(MOUNT) H5.V2(MOUNT) H5.V3(MOUNT) H5.V4(MOUNT) H5.V5(MOUNT) H5.V6(MOUNT) H5.V7(MOUNT) H5.V8(MOUNT) H5.V9(MOUNT) H5.V10(MOUNT) H6.1(MOUNT) H6.V1(MOUNT) H6.V2(MOUNT) H6.V3(MOUNT) H6.V4(MOUNT) H6.V5(MOUNT) H6.V6(MOUNT) H6.V7(MOUNT) H6.V8(MOUNT) H6.V9(MOUNT) H6.V10(MOUNT) R1.2 R2.2 R9.2 R10.2 R120.2 R125.2
PGND: C1.2 C2.2 C3.2 C4.2 C113.2 C121.2 R1.1 R2.1 R9.1 R10.1 R120.1 R125.1 ; also sheet 2,3

### Notes on the sheet
- PV-B
- PV-A
- EPS
- ADCS
- Variant:

## Library data of the parts
C1-C4 C100 C103-C106 C110 C113 C118 C121 C122 C124 C125 C127 = CougsInSpace-Capacitors:CAP-V: Capacitor - Vertical Orientation; PACKAGE: 1608; SKU: 11-104A; TEMP: X7R; VOLTAGE: 50V
C101 = CougsInSpace-Capacitors:CAP-POL-V: Capacitor Polarized - Vertical Orientation; ESR: Max 900mΩ; PACKAGE: Tant-B; SKU: 16-475A; VOLTAGE: 20V
C102 C126 = CougsInSpace-Capacitors:CAP-V: Capacitor - Vertical Orientation; PACKAGE: 1608; SKU: 11-106A; TEMP: X5R; VOLTAGE: 6.3V
C107 C120 = CougsInSpace-Capacitors:CAP-V: Capacitor - Vertical Orientation; PACKAGE: 1608; SKU: 11-102A; TEMP: X7R; VOLTAGE: 50V
C108 C109 C119 C123 = CougsInSpace-Capacitors:CAP-V: Capacitor - Vertical Orientation; PACKAGE: 3216; SKU: 13-106A; TEMP: X7R; VOLTAGE: 10V
C111 C114 C116 C117 = CougsInSpace-Capacitors:CAP-V: Capacitor - Vertical Orientation; PACKAGE: 3216; SKU: 13-475A; TEMP: C0G; VOLTAGE: 25V
C112 C115 = CougsInSpace-Capacitors:CAP-POL-V: Capacitor Polarized - Vertical Orientation; ESR: Max 400mΩ; PACKAGE: Tant-B; SKU: 16-476A; VOLTAGE: 10V
D1 = CougsInSpace-Sensors:PHOTODIODE: Photodiode; HALF_ANGLE: ±60°; SENSITIVITY: 6.3nA/lx; SKU: 66-0003; VR: 5V
D100 D101 = CougsInSpace-DiscreteSemi:DIODE-TVS-V: Diode Transient Voltage Suppression (TVS) Vertical; CURRENT: 179A; SKU: 53-0002; VB: B6.8V; VS: S5.0V
FB100 = CougsInSpace-Coils:CHOKE-H: Choke (Ferrite Bead) Horizontal; CURRENT: 500mA; DCR: 500mΩ; PACKAGE: 1608; SKU: 36-152A
H1-H6 = CougsInSpace-Hardware:MOUNTING_HOLE: Mounting Hole; SKU: 48-004x
J100 = CougsInSpace-Connectors:1X04: Generic Connector - 4 Conductor; PACKAGE: PicoLock; SKU: 04-0001
J101 = CougsInSpace-Connectors:1X07: Generic Connector - 7 Conductor; PACKAGE: PicoLock; SKU: 04-0007
L100 = CougsInSpace-Coils:MAGNETORQUER: Magnetorquer Coil designed to induce a torque from interaction with Earth's magnetic field; AREA: xxx mm²; DCR: xxΩ x%; SKU: 67-0001
L101 L102 = CougsInSpace-Coils:INDUCTOR-H: Inductor Horizontal; CURRENT: 1.8A; DCR: 100mΩ; PACKAGE: 6060; SKU: 34-103A
LOGO1 = CougsInSpace-Aesthetics:SIGNATURE: Designer's (Artist's) Signature
LOGO100 = CougsInSpace-Aesthetics:CIS-LOGO: Cougs in Space Artwork These are the Cougs in Space logos and mission patches
PV1 PV2 = CougsInSpace-Energy:SOLAR_CELL: Solar Panel UTJ <https://github.com/CougsInSpace/Resources/blob/master/SupplierDocuments/SpectroLabs/2015%20UTJ%20CIC%20Datsheet.pdf>; POWER: 1W; SKU: 02-0001
R1 R2 R9 R10 R105 R107-R113 R115 R120 R122 R123 R125 R130-R134 R137 R138 = CougsInSpace-Resistors:RES-V: Resistor Vertical; PACKAGE: 1608; POWER: 1/10W; SKU: 21-0000; TEMP: 70°C Max 2A
R3-R5 R7 R8 R102 R139 R140 R143 = CougsInSpace-Resistors:RES-V: Resistor Vertical; PACKAGE: 1608; POWER: 1/8W; SKU: 21-1002; TEMP: 25ppm/°C
R6 = CougsInSpace-Resistors:RES-V: Resistor Vertical; PACKAGE: 1608; POWER: 1/5W; SKU: 21-1201; TEMP: 50ppm/°C
R100 R101 R103 R104 = CougsInSpace-Resistors:RES-V: Resistor Vertical; PACKAGE: 1608; POWER: 1/10W; SKU: 21-2201; TEMP: 100ppm/°C
R106 R135 = CougsInSpace-Resistors:RES-V: Resistor Vertical; PACKAGE: 1608; POWER: 1/8W; SKU: 21-1001; TEMP: 25ppm/°C
R114 R129 = CougsInSpace-Resistors:RES-V: Resistor Vertical; PACKAGE: 1608; POWER: 1/10W; SKU: 21-8203; TEMP: 100ppm/°C
R116 R136 = CougsInSpace-Resistors:RES-H-KELVIN: Resistor Horizontal - Kelvin Connection; PACKAGE: 1632; POWER: 1W; SKU: 23-5m00; TEMP: 100ppm/°C
R117 R128 = CougsInSpace-Resistors:RES-H: Resistor Horizontal; PACKAGE: 1608; POWER: 1/8W; SKU: 21-1001; TEMP: 25ppm/°C
R118 R127 = CougsInSpace-Resistors:RES-H: Resistor Horizontal; PACKAGE: 1608; POWER: 1/8W; SKU: 21-1002; TEMP: 25ppm/°C
R119 R126 = CougsInSpace-Resistors:RES-H-KELVIN: Resistor Horizontal - Kelvin Connection; PACKAGE: 3216; POWER: 1/2W; SKU: 23-12m0; TEMP: 35ppm/°C
R121 R124 = CougsInSpace-Resistors:RES-V: Resistor Vertical; PACKAGE: 1608; POWER: 1/10W; SKU: 21-3603; TEMP: 100ppm/°C
R141 R142 = CougsInSpace-Resistors:RES-H: Resistor Horizontal; PACKAGE: 1608; POWER: 1/10W; SKU: 21-0000; TEMP: 70°C Max 2A
RN100 RN101 = CougsInSpace-Resistors:RES-H-PAIRED: Resistor Horizontal - Two Paired Elements; PACKAGE: 1616; POWER: 1/8W; SKU: 26-0005; TEMP: ±25ppm/°C
RT1-RT5 RT100 RT103 = CougsInSpace-Resistors:THERMISTOR-V: Thermistor Vertical; B2585: 3960K 1%; PACKAGE: 1608; SKU: 26-0008
RT101 RT102 = CougsInSpace-Resistors:THERMISTOR-H: Thermistor Horizontal; B2585: 3960K 1%; PACKAGE: 1608; SKU: 26-0008
TP100-TP102 = CougsInSpace-Connectors:TEST_POINT: Test Point Used to probe points in a circuit for debugging or general measurement
U100 U108 = CougsInSpace-IC-Conversion:AD7291: AD7291 12b ADC with 8-single ended channels. I²C interface; SKU: 27-0003
U101 U109 = CougsInSpace-IC-Amplifiers:OPAMP-1: Operational Amplifier - Single; SKU: 08-0002
U102 U104 U106 U107 = CougsInSpace-IC-Amplifiers:INA199: INA199 Current-sense amplifier; GAIN: 100 V/V; SKU: 08-0004
U103 U105 = CougsInSpace-IC-Power:SPV1040: Solar Battery Charger with MPPT SPV1040 <https://github.com/CougsInSpace/Resources/blob/master/SupplierDocuments/ST/SPV1040.pdf>; SKU: 60-0001

## Board
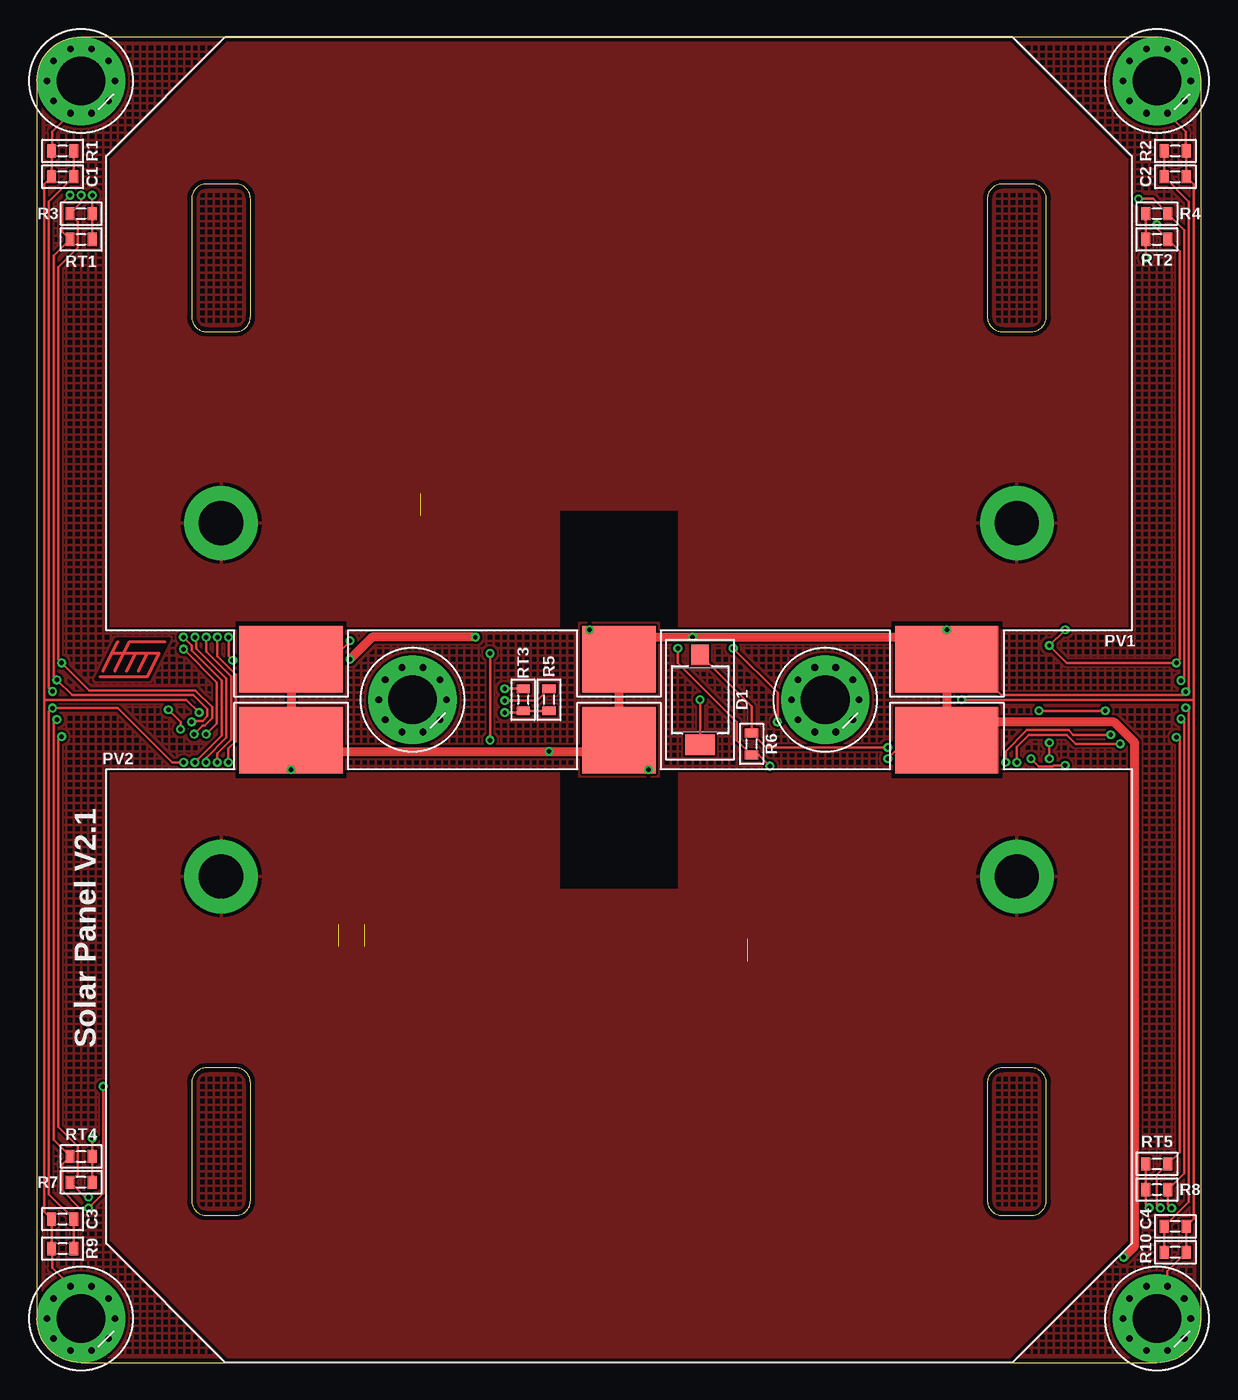
[diagram p5: board, top side]
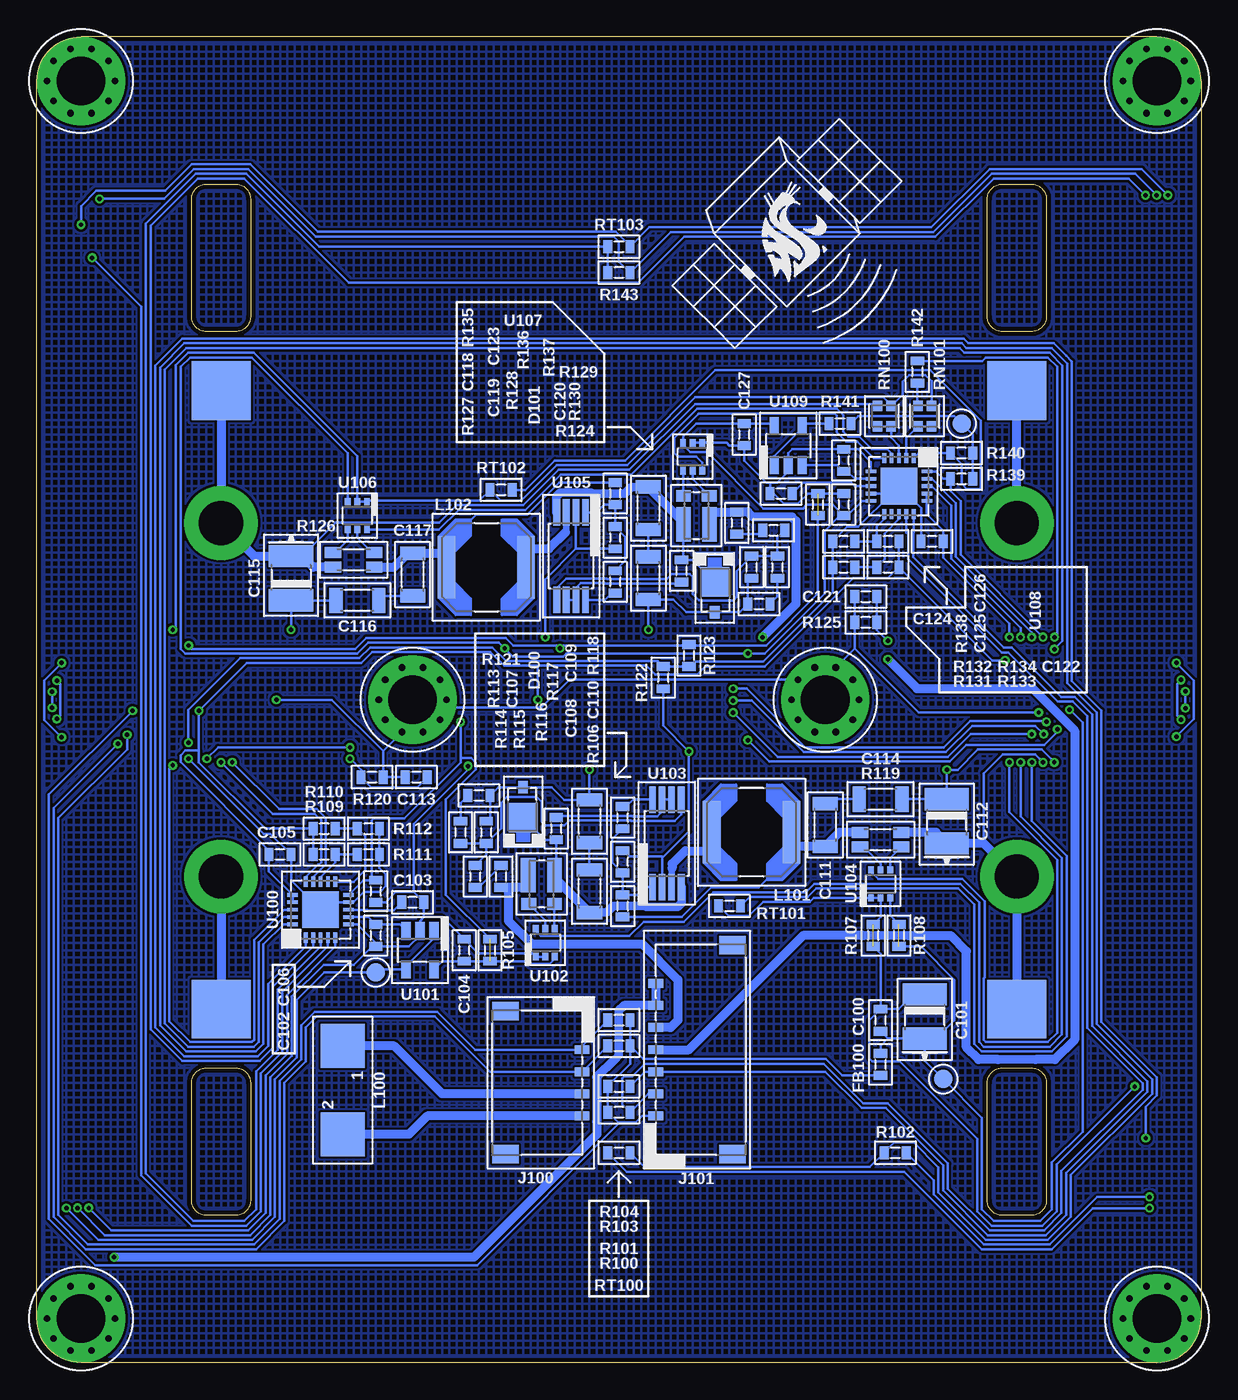
[diagram p6: board, bottom side, seen from below]

Size 79 x 90 mm. Coordinates in mm from the lower left corner, seen from the top.
Outline: 79,3 79,87 arc90 76,90 3,90 arc90 0,87 0,3 arc90 3,0 76,0 arc90 79,3
Copper layers (1*16): Top 0.035mm / dielectric 1.6mm / Bottom 0.035mm
Design rules "CougsInSpace": minimum track width 0.16mm, minimum drill 0.3mm, track to track 0.16mm, track to pad 0.16mm, pad to pad 0.16mm, via to via 0.16mm, smd to smd 0mil, copper to edge 0.3mm, drill to drill 0.3mm, minimum pad ring 0.15mm, minimum via ring 0.15mm, stop-mask expansion 0mil, vias tented up to drill 1mm, thermal gap 0.25mm
bKeepout: area 39.5,0 to 79,90; area 0,0 to 39.5,90

### Footprints (pad centres in the part's own frame; a part is rotated, then mirrored left to right if it is on the bottom)
1608 = smd 0.6 x 0.9: 1 -0.75,0; 2 0.75,0
4028-POL = smd 1.5 x 3: A 1.5,0; C -1.5,0
3216 = smd 0.9 x 1.7: 1 -1.45,0; 2 1.45,0
SFH2430 = smd 1.4 x 1.2: A -3.05,0 | smd 1.4 x 2: C 3.05,0
STMITE = smd 0.85 x 0.65: A -2.055,0 | smd 2 x 1.95: C 0,0
MOUNTING_HOLE-3.3 = drill 3.3 pad 6: 1 0,0 | drill 0.45 pad 0.6: V1 2.3,0; V2 1.861,1.352; V3 0.711,2.187; V4 -0.711,2.187; V5 -1.861,1.352; V6 -2.3,0; V7 -1.861,-1.352; V8 -0.711,-2.187; V9 0.711,-2.187; V10 1.861,-1.352
PICOLOCK1.5-04 = smd 0.6 x 1: 1 2.25,0; 2 0.75,0; 3 -0.75,0; 4 -2.25,0 | smd 1.25 x 1.8: PAD@1 4.855,5.2; PAD@2 -4.855,5.2
PICOLOCK1.5-07 = smd 0.6 x 1: 1 4.5,0; 2 3,0; 3 1.5,0; 4 0,0; 5 -1.5,0; 6 -3,0; 7 -4.5,0 | smd 1.25 x 1.8: PAD@1 7.105,5.2; PAD@2 -7.105,5.2
SMD-3030-2 = smd 3 x 3: 1 -3,0; 2 3,0
6060 = smd 1.2 x 4.25: 1 -2.7,0; 2 2.7,0
SPECTROLABS-UTJ = drill 3 pad 5: VCC@1 -27,-7; VCC@3 27,-7 | smd 4 x 4 bottom: VCC@2 -27,-16; VCC@4 27,-16 | smd 7 x 4.5: VSS@1 -22.25,2.25; VSS@2 22.25,2.25 | smd 5 x 4.5: VSS@3 0,2.25
1632-KELVIN = smd 1 x 2.32: 1 -0.875,-0.59; 2 0.9,-0.59 | smd 1 x 0.8: 1-KELVIN -0.875,1.35; 2-KELVIN 0.875,1.35
3216-KELVIN = smd 1.1 x 0.75: 1 -1.4,-0.5; 1-KELVIN -1.4,0.5; 2 1.4,-0.5; 2-KELVIN 1.4,0.5
1616 = smd 0.64 x 0.7: 1 -0.47,-0.7; 2 0.47,-0.7; 3 0.47,0.7; 4 -0.47,0.7
SMD-C-1.25 = smd 1.25 x 1.25: 1 0,0
QFN-20-4040 = smd 0.7 x 0.25: 1 -1.9,1; 2 -1.9,0.5; 3 -1.9,0; 4 -1.9,-0.5; 5 -1.9,-1; 11 1.9,-1; 12 1.9,-0.5; 13 1.9,0; 14 1.9,0.5; 15 1.9,1 | smd 0.25 x 0.7: 6 -1,-1.9; 7 -0.5,-1.9; 8 0,-1.9; 9 0.5,-1.9; 10 1,-1.9; 16 1,1.9; 17 0.5,1.9; 18 0,1.9; 19 -0.5,1.9; 20 -1,1.9 | smd 2.5 x 2.5: PAD 0,0
SOT23-5 = smd 1.22 x 0.62: 1 -1.31,0.95; 2 -1.31,0; 3 -1.31,-0.95; 4 1.31,-0.95; 5 1.31,0.95
SOT363 = smd 0.5 x 0.4: 1 -0.95,0.65; 2 -0.95,0; 3 -0.95,-0.65; 4 0.95,-0.65; 5 0.95,0; 6 0.95,0.65
TSSOP8 = smd 1.78 x 0.45: 1 -2.97,0.975; 2 -2.97,0.325; 3 -2.97,-0.325; 4 -2.97,-0.975; 5 2.97,-0.975; 6 2.97,-0.325; 7 2.97,0.325; 8 2.97,0.975

### Placement (x,y rotation side)
C1  1.75,80.5 0 top
C2  77.25,80.5 180 top
C3  1.75,9.75 0 top
C4  77.25,9.25 180 top
C100  21.75,23.25 90 bottom
C101  18.75,23.5 270 bottom
C102  56,29 270 bottom
C103  53.5,31.25 0 bottom
C104  50,28 90 bottom
C105  62.5,34.5 0 bottom
C106  56,32 270 bottom
C107  48.5,36 90 bottom
C108  41.5,32 90 bottom
C109  41.5,36.75 90 bottom
C110  39.25,34 90 bottom
C111  25.5,36.5 90 bottom
C112  17.25,36.75 270 bottom
C113  53.25,39.75 0 bottom
C114  21.75,38.25 0 bottom
C115  61.75,53.25 90 bottom
C116  57.25,51.75 180 bottom
C117  53.5,53.5 270 bottom
C118  39.75,56 270 bottom
C119  37.5,53.25 270 bottom
C120  30.5,54 270 bottom
C121  22.75,52 0 bottom
C122  18.25,55.75 180 bottom
C123  37.5,58 270 bottom
C124  28.5,59 180 bottom
C125  24.25,58.25 90 bottom
C126  24.25,61.25 90 bottom
C127  31,63 270 bottom
D1  45,45 270 top
D100  46,37 270 bottom
D101  33,53 90 bottom
FB100  21.75,20.25 90 bottom
H1  3,87 0 top
H2  76,87 0 top
H3  25.5,45 0 top
H4  53.5,45 0 top
H5  3,3 0 top
H6  76,3 0 top
J100  42,19 90 bottom
J101  37,21.25 270 bottom
L100  58.25,18.5 270 bottom
L101  30.5,36 180 bottom
L102  48.5,54 0 bottom
LOGO1  6.5,47.75 0 top
LOGO100  28.1,76.65 90 bottom
PV1  39.5,50 180 top
PV2  39.5,40 0 top
R1  1.75,82.25 180 top
R2  77.25,82.25 0 top
R3  3,78 180 top
R4  76,78 0 top
R5  34.75,45 90 top
R6  48.5,42 90 top
R7  3,12.25 180 top
R8  76,11.75 0 top
R9  1.75,7.75 180 top
R10  77.25,7.5 0 top
R100  39.5,17 180 bottom
R101  39.5,18.75 180 bottom
R102  20.75,14.25 0 bottom
R103  39.5,21.5 0 bottom
R104  39.5,23.25 0 bottom
R105  48.25,28 270 bottom
R106  39.25,31 270 bottom
R107  22.25,29 270 bottom
R108  20.5,29 270 bottom
R109  59.5,34.5 180 bottom
R110  59.5,36.25 180 bottom
R111  56.5,34.5 180 bottom
R112  56.5,36.25 180 bottom
R113  50.25,36 270 bottom
R114  49.25,33 270 bottom
R115  47.5,33 270 bottom
R116  44.75,32.5 180 bottom
R117  43.75,36.25 270 bottom
R118  39.25,37 90 bottom
R119  21.75,35.5 180 bottom
R120  56.25,39.75 0 bottom
R121  49,38.5 180 bottom
R122  36.5,46.5 270 bottom
R123  34.75,48 270 bottom
R124  30,51.5 0 bottom
R125  22.75,50.25 180 bottom
R126  57.5,54.5 0 bottom
R127  39.75,53 270 bottom
R128  35.25,53.75 90 bottom
R129  29,56.5 180 bottom
R130  28.75,54 90 bottom
R131  24.25,54 0 bottom
R132  24.25,55.75 0 bottom
R133  21.25,54 0 bottom
R134  21.25,55.75 0 bottom
R135  39.75,59 90 bottom
R136  34.25,57.5 0 bottom
R137  31.5,57 90 bottom
R138  26,58.25 270 bottom
R139  16.25,60 0 bottom
R140  16.25,61.75 0 bottom
R141  24.5,63.75 0 bottom
R142  19.25,67.25 270 bottom
R143  39.5,74 0 bottom
RN100  21.5,64.25 180 bottom
RN101  18.75,64.25 180 bottom
RT1  3,76.25 0 top
RT2  76,76.25 180 top
RT3  33,45 270 top
RT4  3,14 0 top
RT5  76,13.5 180 top
RT100  39.5,14.25 0 bottom
RT101  32,31 180 bottom
RT102  47.5,59.25 180 bottom
RT103  39.5,75.75 180 bottom
TP100  17.5,19.25 0 bottom
TP101  56,26.5 0 bottom
TP102  16.25,63.75 0 bottom
U100  59.75,30.75 90 bottom
U101  53,28 270 bottom
U102  44.5,28.5 90 bottom
U103  36.25,35.25 90 bottom
U104  21.75,32.5 90 bottom
U105  42.75,54.75 270 bottom
U106  57.25,57.5 270 bottom
U107  34.5,61.5 270 bottom
U108  20.5,59.5 270 bottom
U109  28,62.25 90 bottom

### Tracks (layer width: path | path; a pad name or v marks a point on that pad's centre or on a via)
3.3V  (via drill 0.3)
  Top 0.16: v45,45 D1.C | v72.5,44.25 v68,44.25 | v13.01,49.25 13.01,47.96 v13.29,47.68
  Bottom 0.16: R133.2 R134.2 | R103.2 R104.2 | J101.1 37.91,16.75 38.35,16.31 39.5,16.31 | 39.5,16.31 39.56,16.31 R100.2 R101.2 40.25,18.79 38.75,20.29 R103.2 | U108.17 U108.16 18.6,57.6 17.5,56.5 C122.1 17.5,54.67 13.01,50.18 v13.01,49.25 | U100.17 U100.16 63.25,33.35 C105.1 63.25,34.78 69.25,40.78 69.25,41.22 68.93,41.54 68,41.54 | R109.2 R110.2 63.5,36.25 68,40.75 68,41.54 | R133.2 21.25,53.25 23.59,53.25 29.59,47.25 33.66,47.25 34.2,46.71 37.05,46.71 37.65,47.31 45,47.31 | 68,41.54 v68,44.25 64.75,47.5 56.99,47.5 56.25,48.24 48.22,48.24 47.29,47.31 45,47.31 | v45,45 45,47.31 | R103.2 37.86,20.61 25.45,20.61 24.34,19.5 FB100.1 | 39.5,16.31 39.5,16.24 49.12,6.62 75.04,6.62 78.18,9.76 78.18,38.57 v72.5,44.25 | v13.29,47.68 14.18,47.68 R133.2
ADC_AS0-ADCS
  Bottom 0.16: R110.1 R112.2 56.71,35.71 56.71,33.45 57.51,32.65 U100.11
ADC_AS0-EPS
  Bottom 0.16: U108.11 21.5,57.25 22,56.75 R134.1 R132.2
ADC_AS1-ADCS
  Bottom 0.16: R111.2 R109.1 58.75,33.96 59.75,32.96 U100.13
ADC_AS1-EPS
  Bottom 0.16: R131.2 R133.1 21.46,54.54 21.46,56.29 20.5,57.25 U108.13
ADC_DCAP-ADCS
  Bottom 0.16: U100.8 56.59,30.75 56.55,30.71 54.79,30.71 C103.1
ADC_DCAP-EPS
  Bottom 0.16: U108.8 23.5,59.5 23.75,59.75 27,59.75 C124.1
ADC_VREF-ADCS
  Bottom 0.16: U101.3 54.39,29.75 C102.1 56.5,30.25 U100.7
ADC_VREF-EPS
  Bottom 0.16: U109.3 24.69,60.94 C126.1 24,60.5 23.5,60 U108.7
AGND  (via drill 0.3)  (2 unrouted)
  Top 0.16: v49.74,40.5 48.99,41.25 R6.1 47.5,42.25 47.5,43.5 43.5,47.5 v43.5,48.49 | v69.78,49.75 v69.77,49.75 v68.7,48.68 69.88,47.5 v77.32,47.5 77.54,47.72 77.54,75.46 RT2.1 76,77 v76,77.25 | v76.24,10.5 76,10.74 76,12.75 RT5.1 77.54,14.29 77.54,42.23 v77.32,42.45 | v2.25,79.25 1.71,78.71 1.71,76.79 RT1.1 1.14,75.14 1.14,46.57 v1.36,46.35 2.39,45.32 10.63,45.32 11.58,44.37 11.58,43.9 11.25,43.57 10.57,43.57 v10.5,43.5 | v1.36,43.65 1.14,43.43 1.14,15.11 RT4.1 1.71,13.46 1.71,11.7 2.92,10.49 v3.5,10.49 3.72,10.71 4.5,11.49 v4.5,18.75 | v31.75,45.75 RT3.1
  Bottom 0.16: 29.25,59.75 C124.2 29,59 28.31,58.31 27.35,58.31 26.66,59 R138.1 C125.2 | U108.6 22.4,61.15 23.25,62 C126.2 27.75,62 28,61.75 U109.2 28,60.5 28.75,59.75 29.25,59.75 | U107.2 U107.1 32.2,62.45 32,62.25 C127.2 31,61.25 29.5,59.75 29.25,59.75 | 52.75,30.25 C103.2 53.44,31.94 | C106.2 55.34,31.25 54.65,31.94 53.44,31.94 | C102.2 53.75,28.25 53,29 U101.2 53,30 52.75,30.25 | 52.75,30.25 51.5,30.25 C104.2 49.04,27.79 45.39,27.79 U102.1 U102.2 | U100.6 57.25,29.75 56,28.5 C102.2 | 18.28,65.03 RN101.1 18.28,66.62 18.7,67.04 19.8,67.04 20.25,66.59 20.25,65.73 RN100.1 21.03,65.02 21.55,65.54 34.32,65.54 38.93,60.93 43.72,60.93 46.13,58.52 47.52,58.52 RT102.2 48.98,58.52 56.52,58.52 U106.1 U106.2 57.25,61.54 64.27,68.56 68.73,68.56 69.56,67.73 69.56,49.97 v69.78,49.75 | RT101.2 32.06,30.31 30.69,30.31 29.71,31.29 26.55,31.29 26.3,31.55 U104.1 U104.2 21.75,30.25 R107.1 | v49.74,40.5 49.74,40.26 53.44,36.56 53.44,31.94 | C102.2 56.25,28.25 57.5,27 59.55,27 61.7,24.85 61.7,20.84 63.16,19.38 63.16,10.02 64.52,8.66 74.4,8.66 v76.24,10.5 | R138.2 26,52.2 29.52,48.69 34.75,48.69 | v68.7,48.68 68.48,48.46 57.39,48.46 56.65,49.2 47.2,49.2 46.68,48.69 43.7,48.69 v43.51,48.49 | v43.51,48.49 v43.5,48.49 | 34.75,48.69 43.31,48.69 v43.51,48.49 | v77.32,47.5 78.5,46.32 78.5,43.63 v77.32,42.45 | v76,77.25 76,78.51 74.97,79.54 70.28,79.54 68.48,81.34 64.52,81.34 59.94,76.76 39.72,76.76 38.75,75.79 RT103.1 37.43,77.07 18.29,77.07 14.34,81.02 4.02,81.02 v2.25,79.25 | v1.36,43.65 1.63,43.92 1.63,46.08 v1.36,46.35 | v10.5,43.5 10.55,43.55 15.65,43.55 17.44,41.76 26.84,41.76 30.83,45.75 v31.75,45.75
  Bottom 0.16: RT100.1 38.96,12.96 20.13,12.96 14.87,7.7 10.13,7.7 7.34,10.49 v3.5,10.49 | R123.1 34.75,48.69 | C100.2 20.5,24 19.5,25 C101.C | R107.2 21.75,27.75 C100.2 | C100.2 22.5,23.25 22.5,20.66 22.3,20.46 20.46,20.46 15.2,15.2 15.2,10.29 14.21,9.3 10.79,9.3 9.8,10.29 9.8,13.45 v4.5,18.75
AVDD  (via drill 0.3)  (2 unrouted)
  Top 0.16: v47.25,48.49 50.26,45.48 v50.26,43.51 v50.25,43.5 | v8.93,44.33 9.75,43.5 v9.75,43 | v30.75,42.26 v30.75,48.15
  Bottom 0.16: U109.5 29.14,63.75 C127.1 34.25,63.75 35.15,62.85 U107.3 35.15,62.31 34.66,61.82 33.52,61.82 29.69,57.99 27.01,57.99 26.75,58.25 25,58.25 24.38,57.62 | U108.10 23,58.5 24,57.5 C125.1 24.38,57.62 | U101.5 51.49,27.25 C104.1 R105.2 45.64,27.25 45.45,27.06 44.2,27.06 43.85,27.41 U102.3 | U100.10 56.85,32.75 C106.1 56.29,33.04 56.29,36.8 56.15,36.94 54.06,36.94 50.25,40.75 50.25,41 | 50.25,41 v50.25,43.5 | v47.25,48.49 47.03,48.27 | 24.38,57.62 25.54,56.46 25.54,52.21 29.61,48.15 v30.75,48.15 43.08,48.15 43.28,47.95 46.71,47.95 v47.25,48.49 | v47.25,48.49 47.64,48.88 56.52,48.88 57.25,48.14 68.92,48.14 69.24,48.46 69.24,67.6 68.6,68.24 64.4,68.24 57.9,61.74 U106.3 | C100.1 21.25,22 | 21.25,22 C101.A | FB100.2 21.75,21.5 21.25,22 | R108.1 21.1,30.35 U104.3 | R108.2 19,28.25 16.75,26 16.75,23.25 18.25,21.75 18.5,21.75 C101.A | C101.A 18.75,20.5 TP100.1 14.88,16.63 14.88,10.42 14.08,9.62 10.92,9.62 10.12,10.42 10.12,13.58 8.04,15.66 8.04,43.44 v8.93,44.33 | R105.1 51.25,31.75 51.25,38.23 49.2,40.28 49.2,40.72 49.52,41.04 50.21,41.04 50.25,41 | v30.75,42.26 29.29,40.8 17.05,40.8 15.92,41.93 10.65,41.93 9.75,42.83 v9.75,43
AVREF-0
  Bottom 0.16: R141.2 23.25,64.25 16.75,64.25 TP102.1 15.5,63 R140.2 R139.2
AVREF-1  (via drill 0.3)
  Top 0.16: v77,10.5 76.75,10.75 R8.2 77.86,12.86 77.86,43.48 v77.64,43.7 | v77.64,46.3 77.86,46.52 77.86,76.89 R4.2 75.75,79 v74.75,79 | v3.01,79.25 3.01,78.76 R3.2 2.79,77.46 2.79,75.7 1.46,74.37 1.46,47.72 v1.68,47.5 3.54,45.64 10.76,45.64 11.9,44.5 11.9,43.77 11.38,43.25 11.26,43.25 v10.68,42.66 | v1.68,42.5 1.46,42.28 1.46,16 2.79,14.67 2.79,12.79 R7.2 3.25,11.25 v3.5,11.25 | v31.75,44.94 33.94,44.94 R5.2
  Bottom 0.16: U101.1 52.05,28.84 53.95,26.94 U101.4 55.81,26.69 TP101.1 59.5,26.5 61.38,24.62 61.38,20.71 62.84,19.25 62.84,9.89 64.39,8.34 74.84,8.34 v77,10.5 | v77.64,46.3 77.42,46.08 77.42,43.92 v77.64,43.7 | v74.75,79 70.36,79 68.34,81.02 64.66,81.02 60.08,76.44 39.85,76.44 39.5,76.09 39.5,74.75 R143.2 36,76.75 18.16,76.75 14.21,80.7 4.46,80.7 v3.01,79.25 | v1.68,47.5 0.5,46.32 0.5,43.68 v1.68,42.5 | v10.68,42.66 11.24,43.23 15.52,43.23 17.31,41.44 26.98,41.44 30.48,44.94 v31.75,44.94 | R102.2 18.14,12.39 18.14,11.42 14.74,8.02 10.26,8.02 7.03,11.25 v3.5,11.25
AVREF-BUFF
  Bottom 0.16: U109.1 28.95,61.55 27.05,63.45 U109.4 26.86,63.75 R141.1
BALANCING-BOTTOM
  pour Bottom (hatched): 67.75,90 76,90 arc-90 79,87 79,72.75 79,3 arc-90 76,0 41,0 3,0 arc-90 0,3 0,46.75 0,87 arc-90 3,90
BALANCING-TOP
  pour Top (rank 6, hatched): 76,90 3,90 arc90 0,87 0,3 arc90 3,0 76,0 arc90 79,3 79,87 arc90
CHASSIS  (via drill 0.3)
  Top 0.16: H2.1 76.71,86.29 H2.V9 77.96,83.56 77.96,82.29 R2.2 C2.1 78.5,80 78.5,45 | H2.1 77.35,85.65 H2.V10 | H2.1 75.29,86.29 H2.V8 | H2.1 74.65,85.65 H2.V7 | H2.1 H2.V6 | H2.1 H2.V1 | H2.1 76.71,87.71 H2.V3 | H2.1 75.29,87.71 H2.V4 | H2.1 74.65,88.35 H2.V5 | H2.1 77.35,88.35 H2.V2 | H1.1 2.29,86.29 H1.V8 1.04,83.56 1.04,82.29 R1.2 C1.1 0.5,80 0.5,45 | H1.1 3.71,86.29 H1.V9 | H1.1 3.71,87.71 H1.V3 | H1.1 2.29,87.71 H1.V4 | H1.1 H1.V6 | H1.1 H1.V1 | H1.1 4.35,88.35 H1.V2 | H1.1 1.65,88.35 H1.V5 | H1.1 1.65,85.65 H1.V7 | H1.1 4.35,85.65 H1.V10 | H5.1 2.29,3.71 H5.V4 1.04,6.44 1.04,7.71 R9.2 C3.1 0.5,10.25 0.5,45 | H5.1 3.71,3.71 H5.V3 | H5.1 3.71,2.29 H5.V9 | H5.1 2.29,2.29 H5.V8 | H5.1 1.65,1.65 H5.V7 | H5.1 H5.V6 | H5.1 1.65,4.35 H5.V5 | H5.1 4.35,4.35 H5.V2 | H5.1 H5.V1 | H5.1 4.35,1.65 H5.V10 | H6.1 76.71,3.71 H6.V3 76.71,6.21 R10.2 C4.1 78.5,9.75 78.5,45 | H6.1 76.71,2.29 H6.V9 | H6.1 75.29,2.29 H6.V8 | H6.1 75.29,3.71 H6.V4 | H6.1 H6.V6 | H6.1 H6.V1 | H6.1 77.35,4.35 H6.V2 | H6.1 77.35,1.65 H6.V10 | H6.1 74.65,1.65 H6.V7 | H6.1 74.65,4.35 H6.V5 | H3.1 26.21,45.71 H3.V3 | H3.1 24.79,45.71 H3.V4 | H3.1 24.79,44.29 H3.V8 | H3.1 26.21,44.29 H3.V9 | H3.1 26.85,43.65 H3.V10 | H3.1 24.15,43.65 H3.V7 | H3.1 24.15,46.35 H3.V5 | H3.1 26.85,46.35 H3.V2 | H3.1 H3.V6 | H3.1 H3.V1 | H4.1 54.21,45.71 H4.V3 | H4.1 52.79,45.71 H4.V4 | H4.1 54.21,44.29 H4.V9 | H4.1 52.79,44.29 H4.V8 | H4.1 52.15,46.35 H4.V5 | H4.1 54.85,46.35 H4.V2 | H4.1 54.85,43.65 H4.V10 | H4.1 52.15,43.65 H4.V7 | H4.1 H4.V6 | H4.1 H4.V1 | v62.75,45 78.5,45 | v11.01,44.13 10.15,45 0.5,45
  Bottom 0.16: C121.1 R125.2 23.5,48.48 | 23.5,48.48 H3.V4 | 55.5,41.52 R120.2 C113.1 | 55.5,41.52 H4.V9 | 55.5,41.52 58.98,45 v62.75,45 | v11.01,44.13 19.16,44.13 23.5,48.48 | H3.1 26.89,46.39 42.85,46.39 44.78,44.46 52.96,44.46 H4.1
DGND  (via drill 0.3)
  Top 0.16: v68.71,41 v68.71,42.08
  Bottom 0.16: U108.9 21,59 | 21,59 U108.PAD 19,58 C122.2 | 21,59 23.25,56.75 24,56.75 R132.1 R131.1 25,52.3 29.69,47.6 34.39,47.6 R123.2 R122.1 36.88,47.63 47.15,47.63 48.08,48.56 56.38,48.56 57.12,47.82 65.19,47.82 68.71,44.3 v68.71,42.08 | R112.1 R111.1 55.75,33.59 55.31,33.15 55.31,32.35 55.7,31.96 56.83,31.96 57.54,31.25 U100.9 59.25,31.25 U100.PAD 61.75,32.75 C105.2 63.14,35.89 63.61,35.89 v68.71,41
I2C_SCL_ADCS  (via drill 0.3)
  Top 0.16: v73.51,42.01 70.49,42.01 69.88,42.62 67.32,42.62 66.5,41.8 v66.5,40.75
  Bottom 0.16: R103.1 J100.2 48.25,19.75 52,23.5 60,23.5 60.74,22.76 60.74,20.44 62.2,18.98 62.2,9.63 64.13,7.7 75.67,7.7 77.86,9.89 77.86,37.65 v73.51,42.01 | U100.15 60.75,32.96 59.9,33.81 59.85,33.81 59.71,33.95 59.71,36.83 60.13,37.25 63,37.25 v66.5,40.75
I2C_SCL_PMIC
  Bottom 0.16: R101.1 37.75,19.75 J101.3 25.5,19.75 23.04,17.29 21.41,17.29 17.5,13.38 17.5,11.68 14.48,8.66 10.52,8.66 9.16,10.02 9.16,12.87 3.64,18.39 3.64,19.11 7.4,22.87 7.4,44.02 8.57,45.19 9.5,45.19 12.86,48.54 13.39,48.54 19.54,54.7 19.54,56.3 19.5,56.34 U108.15
I2C_SDA_ADCS  (via drill 0.3)
  Top 0.16: v72.88,42.62 70.33,42.62 70.01,42.94 67.18,42.94 65.74,41.5 v65.74,40.75
  Bottom 0.16: R104.1 42,21.5 J100.1 49.25,21.25 51.82,23.82 60.13,23.82 61.06,22.89 61.06,20.57 62.52,19.11 62.52,9.76 64.26,8.02 75.53,8.02 77.54,10.03 77.54,36.96 72.88,41.62 v72.88,42.62 | U100.14 60.25,32.96 59.72,33.49 59.39,33.82 59.39,36.97 60,37.57 62.56,37.57 v65.74,40.75
I2C_SDA_PMIC
  Bottom 0.16: J101.2 37.5,18.25 R100.1 39.29,17.54 39.29,19.3 39.15,19.44 38.6,19.44 37.75,20.29 25.59,20.29 22.91,17.61 21.27,17.61 17.18,13.52 17.18,11.82 14.34,8.98 10.66,8.98 9.48,10.16 9.48,13.01 3.96,18.53 3.96,18.97 7.72,22.73 7.72,43.88 8.7,44.87 9.71,44.87 13.07,48.22 13.52,48.22 19.86,54.56 19.86,56.2 20,56.34 U108.14
I_OUT-A  (via drill 0.3)
  Top 0.16: v12.24,40.75 12.24,41.37 13.18,42.31 13.18,46.58 11.49,48.26 v11.49,49.25
  Bottom 0.16: U102.6 45.15,29.31 44.8,28.96 38.79,28.96 37.82,29.93 35.12,29.93 33.12,31.93 26.82,31.93 26.25,32.5 16.33,32.5 15.06,31.23 15.06,21.77 14.73,21.44 10.27,21.44 9.44,22.27 9.44,34.27 12.24,37.07 v12.24,40.75 | U108.19 18.29,60 16.64,58.35 16.64,54.71 11.49,49.56 v11.49,49.25
I_OUT-B
  Bottom 0.16: U107.6 33.85,61.1 34.25,61.5 35.5,61.5 35.75,61.75 35.75,62.75 34.12,64.38 34.09,64.41 34.06,64.44 24.85,64.44 24.71,64.3 24.71,63.17 24.08,62.54 23.34,62.54 22.2,61.4 U108.5
MAGNETORQUER-IN
  Bottom 0.6: J100.3 51.5,18.25 54.75,21.5 L100.1
MAGNETORQUER_OUT
  Bottom 0.6: J100.4 52.5,16.75 53.75,15.5 L100.2
MPPT_FBRES_HIGH-A
  Bottom 0.16: R115.1 49,32.25 R114.2
MPPT_FBRES_HIGH-B
  Bottom 0.16: R137.1 30,56.25 R129.2
MPPT_FBRES_LOW-A
  Bottom 0.16: R121.2 50.25,38 R113.1
MPPT_FBRES_LOW-B
  Bottom 0.16: R130.1 28.75,52 R124.2
MPPT_ICTRL-A
  Bottom 0.16: U103.6 U103.7 36.58,37.42 36.9,37.09 38.55,37.09 38.57,37.11 43.64,37.11 R117.1
MPPT_ICTRL-B
  Bottom 0.16: U105.6 U105.7 42.42,52.58 42.1,52.91 40.45,52.91 40.43,52.89 35.36,52.89 R128.1
MPPT_LX-A
  Bottom 0.16: 35.89,33.58 35.92,33.58
  Bottom 0.45: 35.92,33.58 U103.3
  Bottom 0.6: 35.89,33.58 35.89,33.86 35,34.75 33.63,34.75 33.2,35.18 L101.2
MPPT_LX-B
  Bottom 0.45: U105.3 43.08,56.42 43.12,56.38
  Bottom 0.6: L102.2 45.8,54.82 45.37,55.25 44.25,55.25 43.12,56.38
MPPT_OUTCAP-A
  Bottom 0.16: C108.2 C109.1
MPPT_OUTCAP-B
  Bottom 0.16: C123.2 C119.1
MPPT_SET-A
  Bottom 0.16: U103.1 37.72,32.28 38.25,31.75 R106.1 C110.1 39.94,33.94 39.94,35.56 R118.1
MPPT_SET-B
  Bottom 0.16: R127.1 39.06,54.44 39.06,56.06 C118.1 R135.1 40.5,58.25 41.03,57.72 U105.1
MPPT_VCTRL-A
  Bottom 0.16: C107.1 47.5,36.25 47.5,38 47.11,38.39 45.08,38.39 44.75,38.06 44.75,36.75 44.46,36.46 43.2,36.46 42.87,36.79 38.7,36.79 38.68,36.77 35.73,36.77 35.27,37.23 U103.5 | C107.1 R113.2 | R114.1 48.5,34.5 C107.1
MPPT_VCTRL-B
  Bottom 0.16: U105.5 43.73,52.58 43.08,53.23 40.32,53.23 40.3,53.21 36.24,53.21 35.91,53.54 34.7,53.54 34.5,53.34 34.5,52.19 34.07,51.76 34.01,51.76 34,51.75 31.75,51.75 31.5,52 31.5,53.75 C120.1 R130.2 28.75,56 R129.1
MPPT_VOUT-A
  Bottom 0.16: R116.1 43.75,33.22 R117.2 44.5,35.5 D100.C | U103.4 35.25,32.28
  Bottom 0.58: C108.1 40.34,30.55 39.89,31 37.7,31 37.64,30.94 35.51,30.94 35.25,31.2 35.25,32.28
  Bottom 0.6: R116.1 43.88,32.92 C108.1
MPPT_VOUT-B
  Bottom 0.16: R136.1 35.12,54.62 R128.2 34.5,54.5 D101.C | U105.4 43.75,57.72
  Bottom 0.58: 43.75,57.72 43.75,58.8 43.49,59.06 41.36,59.06 41.3,59 39.11,59 38.66,59.45 C123.1
  Bottom 0.6: C123.1 35.12,57.08 R136.1
OUTPUT_CAP-A
  Bottom 0.16: C111.2 25.2,38.25 C114.1
OUTPUT_CAP-B
  Bottom 0.16: C116.1 55.5,52.05 C117.2
PGND  (via drill 0.3)
  Top 0.16: R2.1 C2.2 78.18,78.82 78.18,45.76 v77.96,45.54 77.74,45.32 65.43,45.32 65,45.75 63.75,45.75 PV1.VSS@1 v61.75,49.75 | R1.1 C1.2 0.82,78.82 0.82,45.81 v1.06,45.56 | R9.1 C3.2 0.82,11.43 0.82,44.19 v1.06,44.44 5.5,44.44 9.18,40.75 v9.96,40.75 | R10.1 C4.2 76.51,9.25 78.18,10.92 78.18,44.24 v77.96,44.46 | PV1.VSS@3 v37.5,49.75 | 17.38,41.88 17.25,41.75 v17.25,40.25 PV2.VSS@1 | v57.75,41 59.25,42.5 61.75,42.5 | v21.25,49 19.5,47.25 17.25,47.25 | PV2.VSS@3 v41.5,40.25
  Top 0.6: 61.75,42.5 PV1.VSS@1 60.25,49.25 v44.5,49.25 41,49.25 PV1.VSS@3 PV2.VSS@3 38.75,41.5 v34.75,41.5 17.75,41.5 17.38,41.88 17.25,42 PV2.VSS@1 17.25,47.25 PV1.VSS@2 | 61.75,42.5 PV2.VSS@2 | v73.75,7.16 74.49,7.9 74.49,42.1 73.11,43.48 62.73,43.48 61.75,42.5
  Bottom 0.16: C120.2 30.75,53 R124.1 31.3,50.95 D101.A 34.95,50.95 35.8,51.8 C119.2 v37.5,49.75 | C110.2 38.85,34.35 36.58,34.35 36.58,34.25 | C107.2 48.25,37 R121.1 47.7,39.05 D100.A 44.05,39.05 43.2,38.2 C109.2 v41.5,40.25 | C114.2 C112.C v17.25,40.25 16.5,40.25 15.14,41.61 10.82,41.61 10.18,40.97 v9.96,40.75 | C121.2 R125.1 22,49.75 v21.25,49 | v61.75,49.75 C115.C C116.2 | v44.5,49.25 44.5,53.17 42.42,55.25 | C118.2 42.42,55.25 | U105.2 42.42,55.25 | v57.75,41 57,40.25 R120.1 56.31,39.06 53.19,39.06 C113.2 | v1.06,45.56 v1.06,44.44 | v77.96,44.46 v77.96,45.54 | U103.2 36.58,34.25 | 36.58,34.25 34.75,36.08 v34.75,41.5 36.5,43.25 R122.2 | 41,19.39 41.01,19.39
  Bottom 0.58: 39.5,23.9 39.5,20.86 39.76,20.6 39.79,20.6 41,19.39
  Bottom 0.6: J101.7 J101.6 39.15,24.25 39.5,23.9 | 41.01,19.39 41.01,16.36 41,16.35 41,15.5 49.34,7.16 v73.75,7.16
PHOTODIODE  (via drill 0.3)
  Top 0.16: D1.A 48.5,44.55 R6.2 49.49,41.76 v57.75,41.76 | v69.78,40.54 69.02,40.54 68.93,40.46 68,40.46 v67.46,41
  Bottom 0.16: U100.18 62.21,30.75 64.26,28.7 64.26,21.9 64.4,21.76 68.6,21.76 70,23.16 70,40.32 v69.78,40.54 | v67.46,41 66.7,41.76 v57.75,41.76
PV_I-A  (via drill 0.3)
  Top 0.16: v12.25,49.25 12.25,47.96 13.5,46.71 13.5,42.17 13,41.68 v13,40.75
  Bottom 0.16: U104.6 22.4,33.31 21.91,32.82 16.2,32.82 14.69,31.31 14.69,26.15 14.74,26.1 14.74,21.9 14.6,21.76 10.4,21.76 9.76,22.4 9.76,34.13 13,37.38 v13,40.75 | U108.18 18.29,59.5 16.96,58.17 16.96,54.58 12.25,49.87 v12.25,49.25
PV_I-B
  Bottom 0.16: U108.4 21,61.71 21.29,62 22.34,62 23.2,62.86 23.95,62.86 24.29,63.2 24.29,64.33 24.72,64.76 34.19,64.76 38.66,60.29 43.46,60.29 45.86,57.88 50.38,57.88 51.72,56.55 U106.6
PV_I_N-A
  Bottom 0.16: R119.2-KELVIN 22.9,35 21.75,33.85 U104.5
PV_I_N-B
  Bottom 0.16: R126.2-KELVIN 56.25,55 57.25,56 U106.5
PV_I_P-A
  Bottom 0.16: R119.1-KELVIN 21.1,34.25 U104.4
PV_I_P-B
  Bottom 0.16: R126.1-KELVIN 58.75,55 57.9,55.85 U106.4
PV_IIN_N-A
  Bottom 0.16: R106.2 35.25,30.25 33.25,32.25 30,32.25 27.75,34.5 27.75,35.25 27.75,35.95 L101.1
  Bottom 0.6: R119.2 24.55,36 C111.1 27.55,35.05 27.75,35.25
PV_IIN_N-B
  Bottom 0.16: L102.1 51.2,55.55 49.19,57.56 45.73,57.56 43.55,59.75 R135.2
  Bottom 0.6: R126.2 54.75,54 53.8,54.95 C117.1 51.45,54.95 51.2,54.7 L102.1
PV_V-A  (via drill 0.3)
  Top 0.16: v10.72,40.75 10.94,40.97 12.54,42.57 12.54,46.31 10.5,48.35 10.5,48.7 v9.95,49.25
  Bottom 0.16: R142.1 14.84,68 14.6,68.24 10.4,68.24 9.76,67.6 9.76,49.44 v9.95,49.25 | 14.75,35.25 14.75,40 13.46,41.29 11.26,41.29 10.94,40.97 v10.72,40.75
  Bottom 0.6: R119.1 18,36 C112.A 14.75,35.25 PV2.VCC@1 PV2.VCC@2 | PV2.VCC@3 PV2.VCC@4
  pour Top: 74,40 65.6,40 65.6,39.6 57.9,39.6 57.9,40 42.3,40 42.3,39.65 36.7,39.65 36.7,40 21.1,40 21.1,39.6 13.4,39.6 13.4,40 5,40 5,8.3 13,0.3 18.35,0.3 66,0.3 74,8.3
PV_V-A_JUMP
  Bottom 0.16: R142.2 19.25,64.98 RN101.2
PV_V-B
  Bottom 0.16: 61,54.75 58.71,57.04 51.68,57.04 50.52,58.2 46,58.2 43.59,60.61 38.8,60.61 34.33,65.08 22.1,65.08 RN100.2
  Bottom 0.6: R126.1 60.25,54 61,54.75 C115.A 64.25,54.75 PV1.VCC@1 PV1.VCC@2 | PV1.VCC@3 PV1.VCC@4
  pour Top: 5,50 13.4,50 13.4,50.4 21.1,50.4 21.1,50 36.7,50 36.7,50.35 42.3,50.35 42.3,50 57.9,50 57.9,50.4 65.6,50.4 65.6,50 74,50 74,81.7 66,89.7 60.65,89.7 13,89.7 5,81.7
PV_V_SENSE-A
  Bottom 0.16: RN101.4 RN101.3 20,62.77 U108.2
PV_V_SENSE-B
  Bottom 0.16: RN100.3 RN100.4 21.03,62.78 20.5,62.25 U108.3
TEMP-0  (via drill 0.3)
  Top 0.16: v31.75,44.13 32.88,44.13 RT3.2 R5.1 | v11.49,42.66 12.22,43.4 12.22,46.18 v9.96,48.44
  Bottom 0.16: U100.19 62.21,30.25 63.94,28.52 63.94,21.77 64.27,21.44 68.73,21.44 70.32,23.03 70.32,67.42 68.86,68.88 16.38,68.88 16.06,68.56 10.27,68.56 9.41,67.7 9.41,48.99 v9.96,48.44 | v11.49,42.66 15.63,42.66 17.18,41.12 28.74,41.12 v31.75,44.13
TEMP-1
  Bottom 0.16: U100.20 62.25,29.75 63.62,28.38 63.62,21.64 64.14,21.12 68.86,21.12 70.64,22.89 70.64,67.56 69,69.2 16.25,69.2 15.93,68.88 10.14,68.88 9.09,67.83 9.09,46.15 7.08,44.15 7.08,23 3.32,19.24 3.32,18.26 8.84,12.74 8.84,9.89 10.39,8.34 14.61,8.34 17.82,11.55 17.82,13.25 19.51,14.94 20.81,14.94 R102.1 22.47,13.28 37.78,13.28 RT100.2
TEMP-2  (via drill 0.3)
  Top 0.16: v3.75,15.25 RT4.2 R7.1
  Bottom 0.16: U100.1 60.75,28.25 63.3,25.7 63.3,21.5 64,20.8 69,20.8 70.96,22.76 70.96,67.69 69.13,69.52 16.11,69.52 15.8,69.2 10,69.2 9.15,68.35 8.8,68 8.77,67.96 8.77,46.29 6.76,44.28 6.76,23.13 3,19.37 3,18.13 3.75,17.38 v3.75,15.25
TEMP-3  (via drill 0.3)
  Top 0.16: v3.77,79.24 3.77,78.02 R3.1 RT1.2
  Bottom 0.16: U100.2 60.25,28.25 62.98,25.52 62.98,21.37 63.87,20.48 69.13,20.48 71.28,22.63 71.28,77.18 68.08,80.38 64.92,80.38 57.85,73.31 38.19,73.31 35.07,76.43 18.03,76.43 14.08,80.38 4.91,80.38 v3.77,79.24
TEMP-4
  Bottom 0.16: U100.3 59.75,28.25 62.66,25.34 62.66,21.24 64.12,19.78 64.12,10.42 64.92,9.62 68.37,9.62 71.6,12.85 71.6,77.31 68.21,80.7 65.5,80.7 64.79,80.7 59.84,75.75 RT103.2 R143.1
TEMP-5  (via drill 0.3)
  Top 0.16: v75.25,75 RT2.2 R4.1
  Bottom 0.16: U100.4 59.25,28.25 62.34,25.16 62.34,21.11 63.8,19.64 63.8,10.29 64.79,9.3 68.5,9.3 71.92,12.72 71.92,71.67 v75.25,75
TEMP-6  (via drill 0.3)
  Top 0.16: v75.48,10.51 75.25,10.74 R8.1 RT5.2
  Bottom 0.16: U100.5 58.75,28.25 62.02,24.98 62.02,20.97 63.48,19.51 63.48,10.16 64.66,8.98 73.95,8.98 v75.48,10.51
TEMP_MPPT-A  (via drill 0.3)
  Top 0.16: v11.48,40.75 11.48,41.06 12.86,42.44 12.86,46.44 10.82,48.48 10.82,49.16 v10.73,49.25
  Bottom 0.16: U108.20 18,60.5 17.5,60 R139.1 17,59.17 16.32,58.49 16.32,54.84 10.95,49.47 v10.73,49.25 | RT101.1 30.64,31.61 26.69,31.61 26.12,32.18 16.46,32.18 15.38,31.1 15.38,21.64 14.86,21.12 10.14,21.12 9.12,22.14 9.12,34.4 11.48,36.76 v11.48,40.75
TEMP_MPPT-B
  Bottom 0.16: RT102.1 45.86,59.25 43.86,61.25 39.06,61.25 32.95,67.36 18.36,67.36 14.96,63.96 14.96,59.31 15.9,59.31 16.25,59.66 16.25,61 R140.1 19.15,61.75 U108.1
UNDER_INDUCTOR-A
  cutout Bottom (rank 5): 32.35,39.4 28.65,39.4 27.25,38 27.25,34 28.65,32.6 32.35,32.6 33.75,34 33.75,38
UNDER_INDUCTOR-B
  cutout Bottom (rank 5): 50.35,57.4 46.65,57.4 45.25,56 45.25,52 46.65,50.6 50.35,50.6 51.75,52 51.75,56
VOUT-A
  Bottom 0.6: R116.2 45.75,32.99 45.75,32.25 47,32.25 | R115.2 47,32.25 | 47,32.25 47,30 45.42,28.42 37.92,28.42 35.5,26 35.5,23.25 36,22.75 36.04,22.75 J101.5
VOUT-B  (via drill 0.3)
  Top 0.6: v29.75,49.25 22.75,49.25 v21.25,47.75
  Bottom 0.58: 11.23,20.58 11.25,20.58 11.26,20.59 13.74,20.59 13.75,20.58 13.77,20.58 | 22.9,29 19.85,29
  Bottom 0.6: R136.2 33.35,57.65 33.25,57.75 R137.2 30.75,57.75 30.41,57.41 27.76,57.41 27.49,57.14 27.49,51.51 v29.75,49.25 | v21.25,47.75 19.26,45.76 11.43,45.76 8.58,42.91 8.58,21.91 9.91,20.58 11.23,20.58 | 13.77,20.58 15.09,20.58 15.92,21.41 15.92,27.92 17,29 19.85,29 | 22.9,29 27,29 34.75,21.25 J101.4
VOUT_N-A
  Bottom 0.16: R116.2-KELVIN 44.5,30.02 U102.5
VOUT_N-B
  Bottom 0.16: R136.2-KELVIN 34.5,59.98 U107.5
VOUT_P-A
  Bottom 0.16: R116.1-KELVIN 43.88,29.48 U102.4
VOUT_P-B
  Bottom 0.16: R136.1-KELVIN 35.15,58.88 U107.4
X_SHUT-A
  Bottom 0.16: R118.2 39,37.75 38.53,38.22 U103.8
X_SHUT-B
  Bottom 0.16: R127.2 40,52.25 40.47,51.78 U105.8

### Text on the board
tPlace: Solar Panel V2.1